# EAGLE design 32BVer0 (EAGLE 5.11)

## Sheet 1 of 3
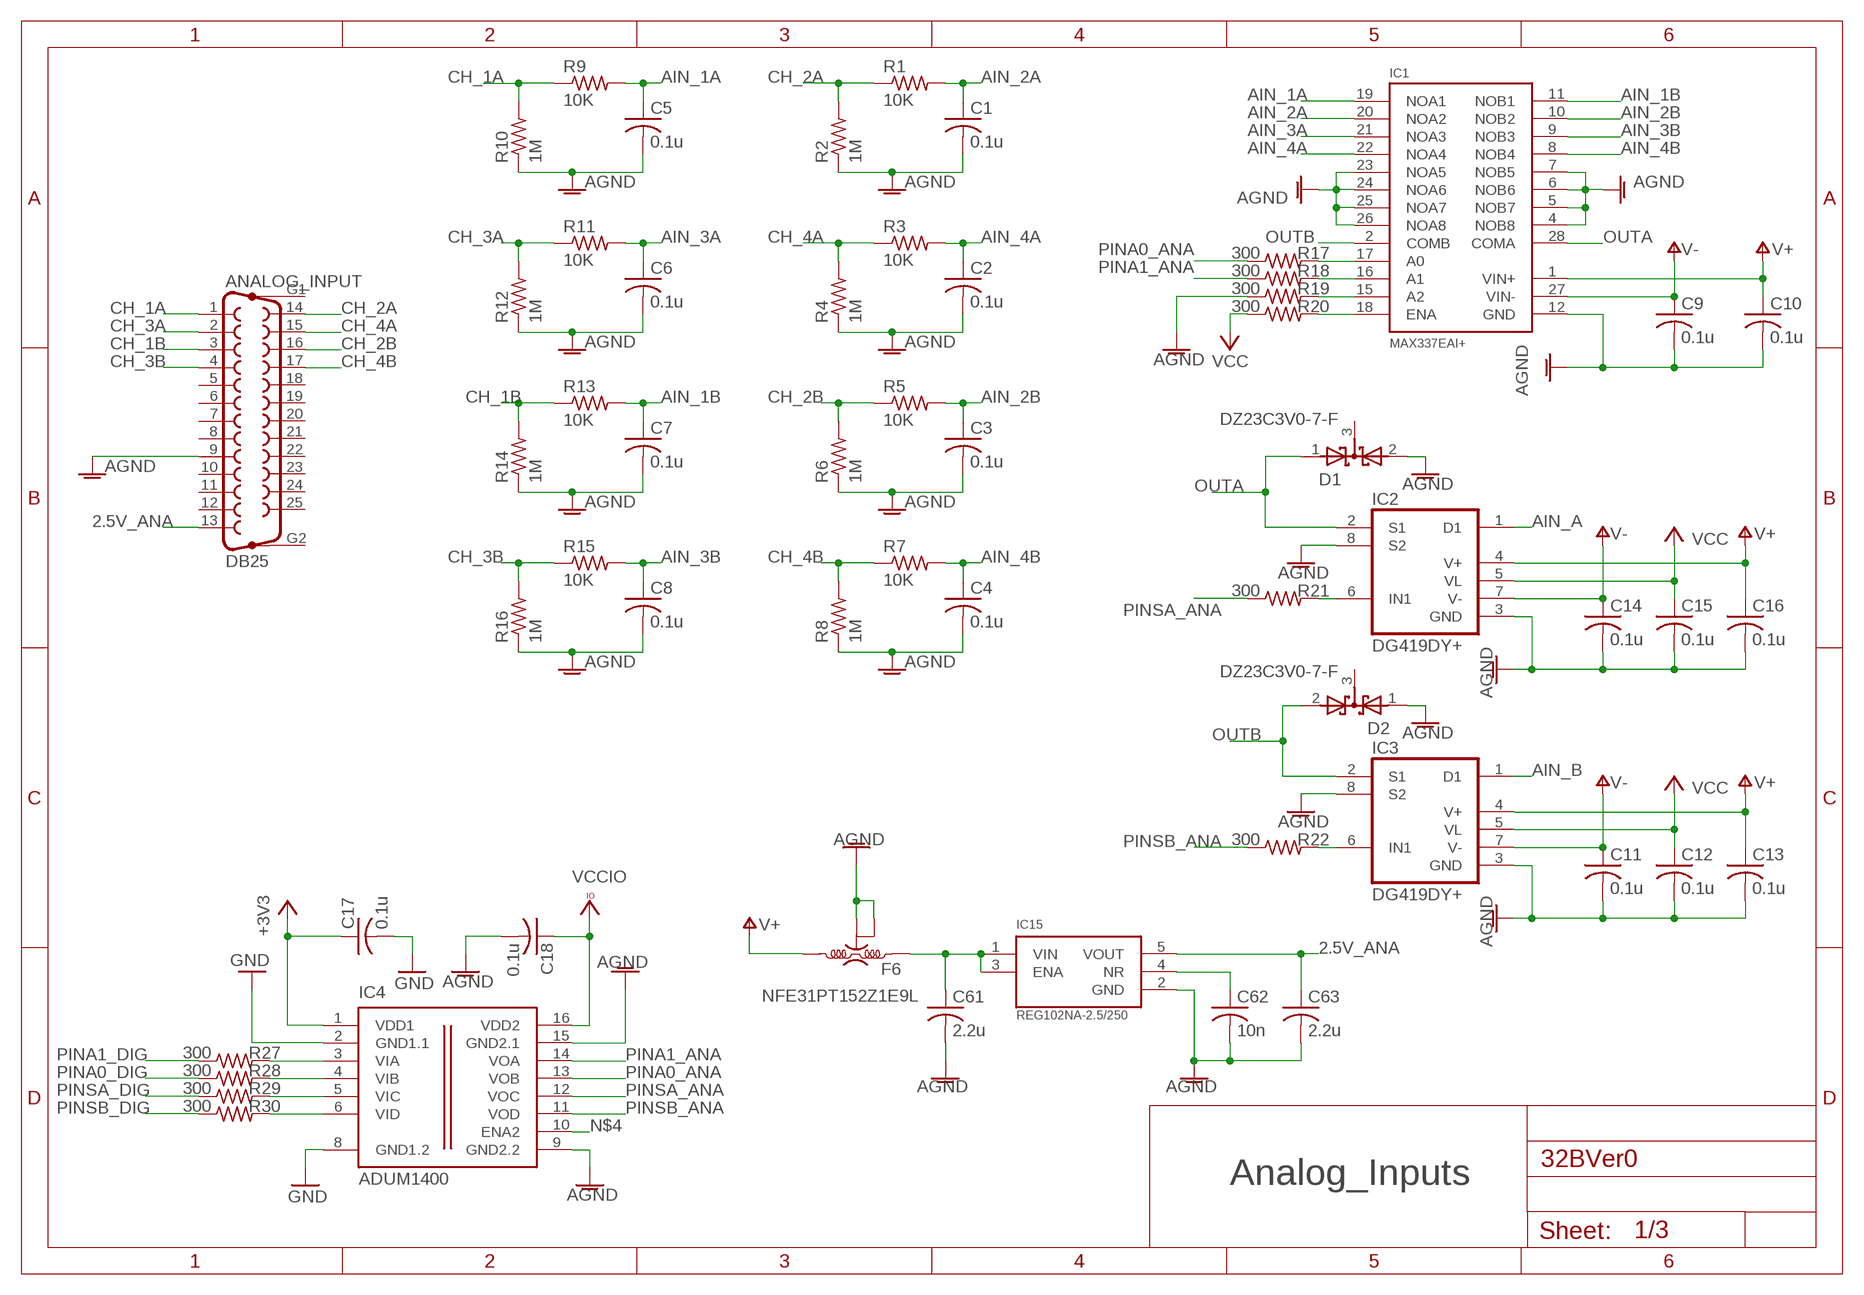
[diagram p0: schematic, sheet 1]

### Parts
ANALOG_INPUT  DB25  F25HP  [F25HP@1]
C1  0.1u  C-USC0603  [C0603]
C2  0.1u  C-USC0603  [C0603]
C3  0.1u  C-USC0603  [C0603]
C4  0.1u  C-USC0603  [C0603]
C5  0.1u  C-USC0603  [C0603]
C6  0.1u  C-USC0603  [C0603]
C7  0.1u  C-USC0603  [C0603]
C8  0.1u  C-USC0603  [C0603]
C9  0.1u  C-USC0603  [C0603]
C10  0.1u  C-USC0603  [C0603]
C11  0.1u  C-USC0603  [C0603]
C12  0.1u  C-USC0603  [C0603]
C13  0.1u  C-USC0603  [C0603]
C14  0.1u  C-USC0603  [C0603]
C15  0.1u  C-USC0603  [C0603]
C16  0.1u  C-USC0603  [C0603]
C17  0.1u  C-USC0603  [C0603]
C18  0.1u  C-USC0603  [C0603]
C61  2.2u  C-USC0603  [C0603]
C62  10n  C-USC0603  [C0603]
C63  2.2u  C-USC0603  [C0603]
D1  DZ23C3V0-7-F  [SOT23]
D2  DZ23C3V0-7-F  [SOT23]
F6  NFE31PT152Z1E9L  [KNF21]
IC1  MAX337EAI+  [SSOP28]
IC2  DG419DY+  [SO08]
IC3  DG419DY+  [SO08]
IC4  ADUM1400  [SO16W]
IC15  REG102NA-2.5/250  REG102-2V5  [SOT23-5]
R1  10K  R-US_R0603  [R0603]
R2  1M  R-US_R0603  [R0603]
R3  10K  R-US_R0603  [R0603]
R4  1M  R-US_R0603  [R0603]
R5  10K  R-US_R0603  [R0603]
R6  1M  R-US_R0603  [R0603]
R7  10K  R-US_R0603  [R0603]
R8  1M  R-US_R0603  [R0603]
R9  10K  R-US_R0603  [R0603]
R10  1M  R-US_R0603  [R0603]
R11  10K  R-US_R0603  [R0603]
R12  1M  R-US_R0603  [R0603]
R13  10K  R-US_R0603  [R0603]
R14  1M  R-US_R0603  [R0603]
R15  10K  R-US_R0603  [R0603]
R16  1M  R-US_R0603  [R0603]
R17  300  R-US_R0603  [R0603]
R18  300  R-US_R0603  [R0603]
R19  300  R-US_R0603  [R0603]
R20  300  R-US_R0603  [R0603]
R21  300  R-US_R0603  [R0603]
R22  300  R-US_R0603  [R0603]
R27  300  R-US_R0603  [R0603]
R28  300  R-US_R0603  [R0603]
R29  300  R-US_R0603  [R0603]
R30  300  R-US_R0603  [R0603]

### Nets
2.5V_ANA: ANALOG_INPUT.13 C63.1 IC15.5(VOUT)
+3V3: C17.1 IC4.1(VDD1) ; also sheet 2,3
AGND: ANALOG_INPUT.9 C1.2 C2.2 C3.2 C4.2 C5.2 C6.2 C7.2 C8.2 C9.2 C10.2 C11.2 C12.2 C13.2 C14.2 C15.2 C16.2 C18.2 C61.2 C62.2 C63.2 D1.2(A2) D2.1(A1) F6.2A(G1) F6.2B(G2) IC1.4(NOB8) IC1.5(NOB7) IC1.6(NOB6) IC1.7(NOB5) IC1.12(GND) IC1.23(NOA5) IC1.24(NOA6) IC1.25(NOA7) IC1.26(NOA8) IC2.3(GND) IC2.8(S2) IC3.3(GND) IC3.8(S2) IC4.9(GND2.2) IC4.15(GND2.1) IC15.2(GND) R2.1 R4.1 R6.1 R8.1 R10.1 R12.1 R14.1 R16.1 R19.1 ; also sheet 2,3
AIN_1A: C5.1 IC1.19(NOA1) R9.2
AIN_1B: C7.1 IC1.11(NOB1) R13.2
AIN_2A: C1.1 IC1.20(NOA2) R1.2
AIN_2B: C3.1 IC1.10(NOB2) R5.2
AIN_3A: C6.1 IC1.21(NOA3) R11.2
AIN_3B: C8.1 IC1.9(NOB3) R15.2
AIN_4A: C2.1 IC1.22(NOA4) R3.2
AIN_4B: C4.1 IC1.8(NOB4) R7.2
AIN_A: IC2.1(D1) ; also sheet 2
AIN_B: IC3.1(D1) ; also sheet 2
CH_1A: ANALOG_INPUT.1 R9.1 R10.2
CH_1B: ANALOG_INPUT.3 R13.1 R14.2
CH_2A: ANALOG_INPUT.14 R1.1 R2.2
CH_2B: ANALOG_INPUT.16 R5.1 R6.2
CH_3A: ANALOG_INPUT.2 R11.1 R12.2
CH_3B: ANALOG_INPUT.4 R15.1 R16.2
CH_4A: ANALOG_INPUT.15 R3.1 R4.2
CH_4B: ANALOG_INPUT.17 R7.1 R8.2
GND: C17.2 IC4.2(GND1.1) IC4.8(GND1.2) ; also sheet 2,3
N$4: IC4.10(ENA2)
N$6: C61.1 F6.1(IN) IC15.1(VIN) IC15.3(ENA)
N$8: C62.1 IC15.4(NR)
N$18: IC1.18(ENA) R20.2
N$19: IC1.15(A2) R19.2
N$20: IC1.16(A1) R18.2
N$21: IC1.17(A0) R17.2
N$32: IC2.6(IN1) R21.2
N$33: IC3.6(IN1) R22.2
N$37: IC4.3(VIA) R27.2
N$38: IC4.4(VIB) R28.2
N$39: IC4.5(VIC) R29.2
N$40: IC4.6(VID) R30.2
OUTA: D1.1(A1) IC1.28(COMA) IC2.2(S1)
OUTB: D2.2(A2) IC1.2(COMB) IC3.2(S1)
PINA0_ANA: IC4.13(VOB) R17.1
PINA0_DIG: R28.1 ; also sheet 3
PINA1_ANA: IC4.14(VOA) R18.1
PINA1_DIG: R27.1 ; also sheet 3
PINSA_ANA: IC4.12(VOC) R21.1
PINSA_DIG: R29.1 ; also sheet 3
PINSB_ANA: IC4.11(VOD) R22.1
PINSB_DIG: R30.1 ; also sheet 3
V+: C10.1 C13.1 C16.1 F6.3(OUT) IC1.1(VIN+) IC2.4(V+) IC3.4(V+) ; also sheet 2,3
V-: C9.1 C11.1 C14.1 IC1.27(VIN-) IC2.7(V-) IC3.7(V-) ; also sheet 2,3
VCC: C12.1 C15.1 IC2.5(VL) IC3.5(VL) R20.1 ; also sheet 2
VCCIO: C18.1 IC4.16(VDD2) ; also sheet 2
Unconnected: ANALOG_INPUT.5 ANALOG_INPUT.6 ANALOG_INPUT.7 ANALOG_INPUT.8 ANALOG_INPUT.10 ANALOG_INPUT.11 ANALOG_INPUT.12 ANALOG_INPUT.18 ANALOG_INPUT.19 ANALOG_INPUT.20 ANALOG_INPUT.21 ANALOG_INPUT.22 ANALOG_INPUT.23 ANALOG_INPUT.24 ANALOG_INPUT.25 ANALOG_INPUT.G1 ANALOG_INPUT.G2 D1.3 D2.3

### Notes on the sheet
- Analog_Inputs

## Sheet 2 of 3
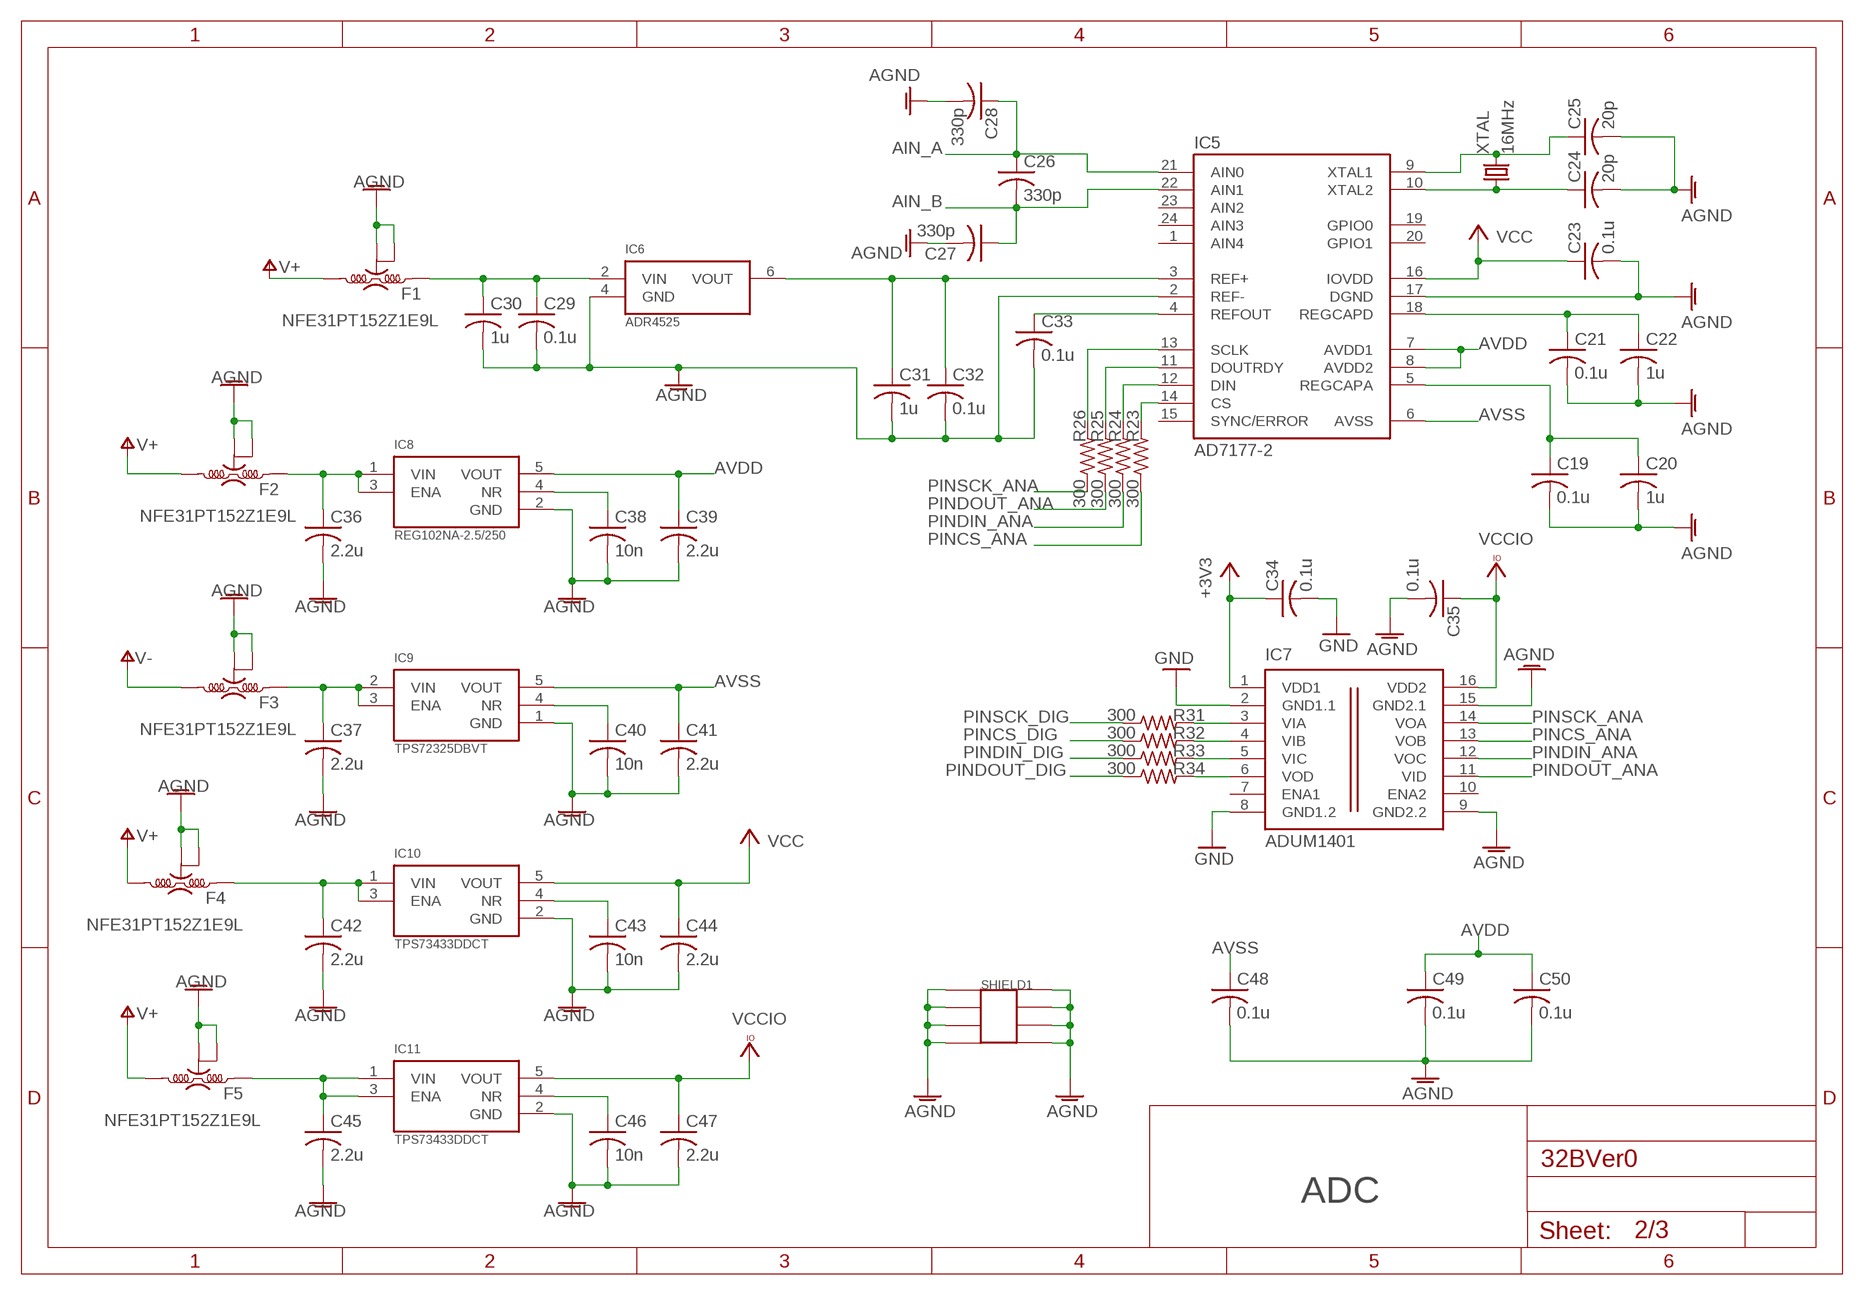
[diagram p1: schematic, sheet 2]

### Parts
C19  0.1u  C-USC0402  [C0402]
C20  1u  C-USC0402  [C0402]
C21  0.1u  C-USC0402  [C0402]
C22  1u  C-USC0402  [C0402]
C23  0.1u  C-USC0402  [C0402]
C24  20p  C-USC0402  [C0402]
C25  20p  C-USC0402  [C0402]
C26  330p  C-USC0402  [C0402]
C27  330p  C-USC0402  [C0402]
C28  330p  C-USC0402  [C0402]
C29  0.1u  C-USC0402  [C0402]
C30  1u  C-USC0402  [C0402]
C31  1u  C-USC0402  [C0402]
C32  0.1u  C-USC0402  [C0402]
C33  0.1u  C-USC0402  [C0402]
C34  0.1u  C-USC0603  [C0603]
C35  0.1u  C-USC0603  [C0603]
C36  2.2u  C-USC0603  [C0603]
C37  2.2u  C-USC0603  [C0603]
C38  10n  C-USC0603  [C0603]
C39  2.2u  C-USC0603  [C0603]
C40  10n  C-USC0603  [C0603]
C41  2.2u  C-USC0603  [C0603]
C42  2.2u  C-USC0603  [C0603]
C43  10n  C-USC0603  [C0603]
C44  2.2u  C-USC0603  [C0603]
C45  2.2u  C-USC0603  [C0603]
C46  10n  C-USC0603  [C0603]
C47  2.2u  C-USC0603  [C0603]
C48  0.1u  C-USC0402  [C0402]
C49  0.1u  C-USC0402  [C0402]
C50  0.1u  C-USC0402  [C0402]
F1  NFE31PT152Z1E9L  [KNF21]
F2  NFE31PT152Z1E9L  [KNF21]
F3  NFE31PT152Z1E9L  [KNF21]
F4  NFE31PT152Z1E9L  [KNF21]
F5  NFE31PT152Z1E9L  [KNF21]
IC5  AD7177-2  AD7177-2BRUZ  [TSSOP24]
IC6  ADR4525  ADR4525CRZ-R7  [SO08]
IC7  ADUM1401  [SO16W]
IC8  REG102NA-2.5/250  REG102-2V5  [SOT23-5]
IC9  TPS72325DBVT  [SOT23-5]
IC10  TPS73433DDCT  [SOT23-5]
IC11  TPS73433DDCT  [SOT23-5]
R23  300  R-US_R0603  [R0603]
R24  300  R-US_R0603  [R0603]
R25  300  R-US_R0603  [R0603]
R26  300  R-US_R0603  [R0603]
R31  300  R-US_R0603  [R0603]
R32  300  R-US_R0603  [R0603]
R33  300  R-US_R0603  [R0603]
R34  300  R-US_R0603  [R0603]
SHIELD1  SHIELD_50X38  [SHIELD_38X50]
XTAL  16MHz  CRYSTALSM49  [SM49]

### Nets
+3V3: C34.1 IC7.1(VDD1) ; also sheet 1,3
AGND: C19.2 C20.2 C21.2 C22.2 C23.2 C24.2 C25.2 C27.2 C28.2 C29.2 C30.2 C31.2 C32.2 C33.2 C35.2 C36.2 C37.2 C38.2 C39.2 C40.2 C41.2 C42.2 C43.2 C44.2 C45.2 C46.2 C47.2 C48.2 C49.2 C50.2 F1.2A(G1) F1.2B(G2) F2.2A(G1) F2.2B(G2) F3.2A(G1) F3.2B(G2) F4.2A(G1) F4.2B(G2) F5.2A(G1) F5.2B(G2) IC5.2(REF-) IC5.17(DGND) IC6.4(GND) IC7.9(GND2.2) IC7.15(GND2.1) IC8.2(GND) IC9.1(GND) IC10.2(GND) IC11.2(GND) SHIELD1.P$1 SHIELD1.P$2 SHIELD1.P$3 SHIELD1.P$4 SHIELD1.P$5 SHIELD1.P$6 SHIELD1.P$7 SHIELD1.P$8 ; also sheet 1,3
AIN_A: C26.1 C28.1 IC5.21(AIN0) ; also sheet 1
AIN_B: C26.2 C27.1 IC5.22(AIN1) ; also sheet 1
AVDD: C39.1 C49.1 C50.1 IC5.7(AVDD1) IC5.8(AVDD2) IC8.5(VOUT)
AVSS: C41.1 C48.1 IC5.6(AVSS) IC9.5(VOUT)
GND: C34.2 IC7.2(GND1.1) IC7.8(GND1.2) ; also sheet 1,3
N$1: C45.1 F5.1(IN) IC11.1(VIN) IC11.3(ENA)
N$2: C21.1 C22.1 IC5.18(REGCAPD)
N$3: C24.1 IC5.10(XTAL2) XTAL.1
N$5: C19.1 C20.1 IC5.5(REGCAPA)
N$7: C25.1 IC5.9(XTAL1) XTAL.2
N$9: C29.1 C30.1 F1.1(IN) IC6.2(VIN)
N$11: C33.1 IC5.4(REFOUT)
N$13: C31.1 C32.1 IC5.3(REF+) IC6.6(VOUT)
N$15: IC5.13(SCLK) R26.2
N$17: IC5.11(DOUTRDY) R25.2
N$22: IC5.12(DIN) R24.2
N$23: IC5.14(CS) R23.2
N$24: C42.1 F4.1(IN) IC10.1(VIN) IC10.3(ENA)
N$25: C37.1 F3.1(IN) IC9.2(VIN) IC9.3(ENA)
N$26: C36.1 F2.1(IN) IC8.1(VIN) IC8.3(ENA)
N$27: C40.1 IC9.4(NR)
N$28: IC7.3(VIA) R31.2
N$29: C38.1 IC8.4(NR)
N$30: C43.1 IC10.4(NR)
N$31: IC7.4(VIB) R32.2
N$34: IC7.5(VIC) R33.2
N$35: IC7.6(VOD) R34.2
N$36: C46.1 IC11.4(NR)
PINCS_ANA: IC7.13(VOB) R23.1
PINCS_DIG: R32.1 ; also sheet 3
PINDIN_ANA: IC7.12(VOC) R24.1
PINDIN_DIG: R33.1 ; also sheet 3
PINDOUT_ANA: IC7.11(VID) R25.1
PINDOUT_DIG: R34.1 ; also sheet 3
PINSCK_ANA: IC7.14(VOA) R26.1
PINSCK_DIG: R31.1 ; also sheet 3
V+: F1.3(OUT) F2.3(OUT) F4.3(OUT) F5.3(OUT) ; also sheet 1,3
V-: F3.3(OUT) ; also sheet 1,3
VCC: C23.1 C44.1 IC5.16(IOVDD) IC10.5(VOUT) ; also sheet 1
VCCIO: C35.1 C47.1 IC7.16(VDD2) IC11.5(VOUT) ; also sheet 1
Unconnected: IC5.1(AIN4) IC5.15(SYNC/ERROR) IC5.19(GPIO0) IC5.20(GPIO1) IC5.23(AIN2) IC5.24(AIN3)

### Notes on the sheet
- ADC

## Sheet 3 of 3
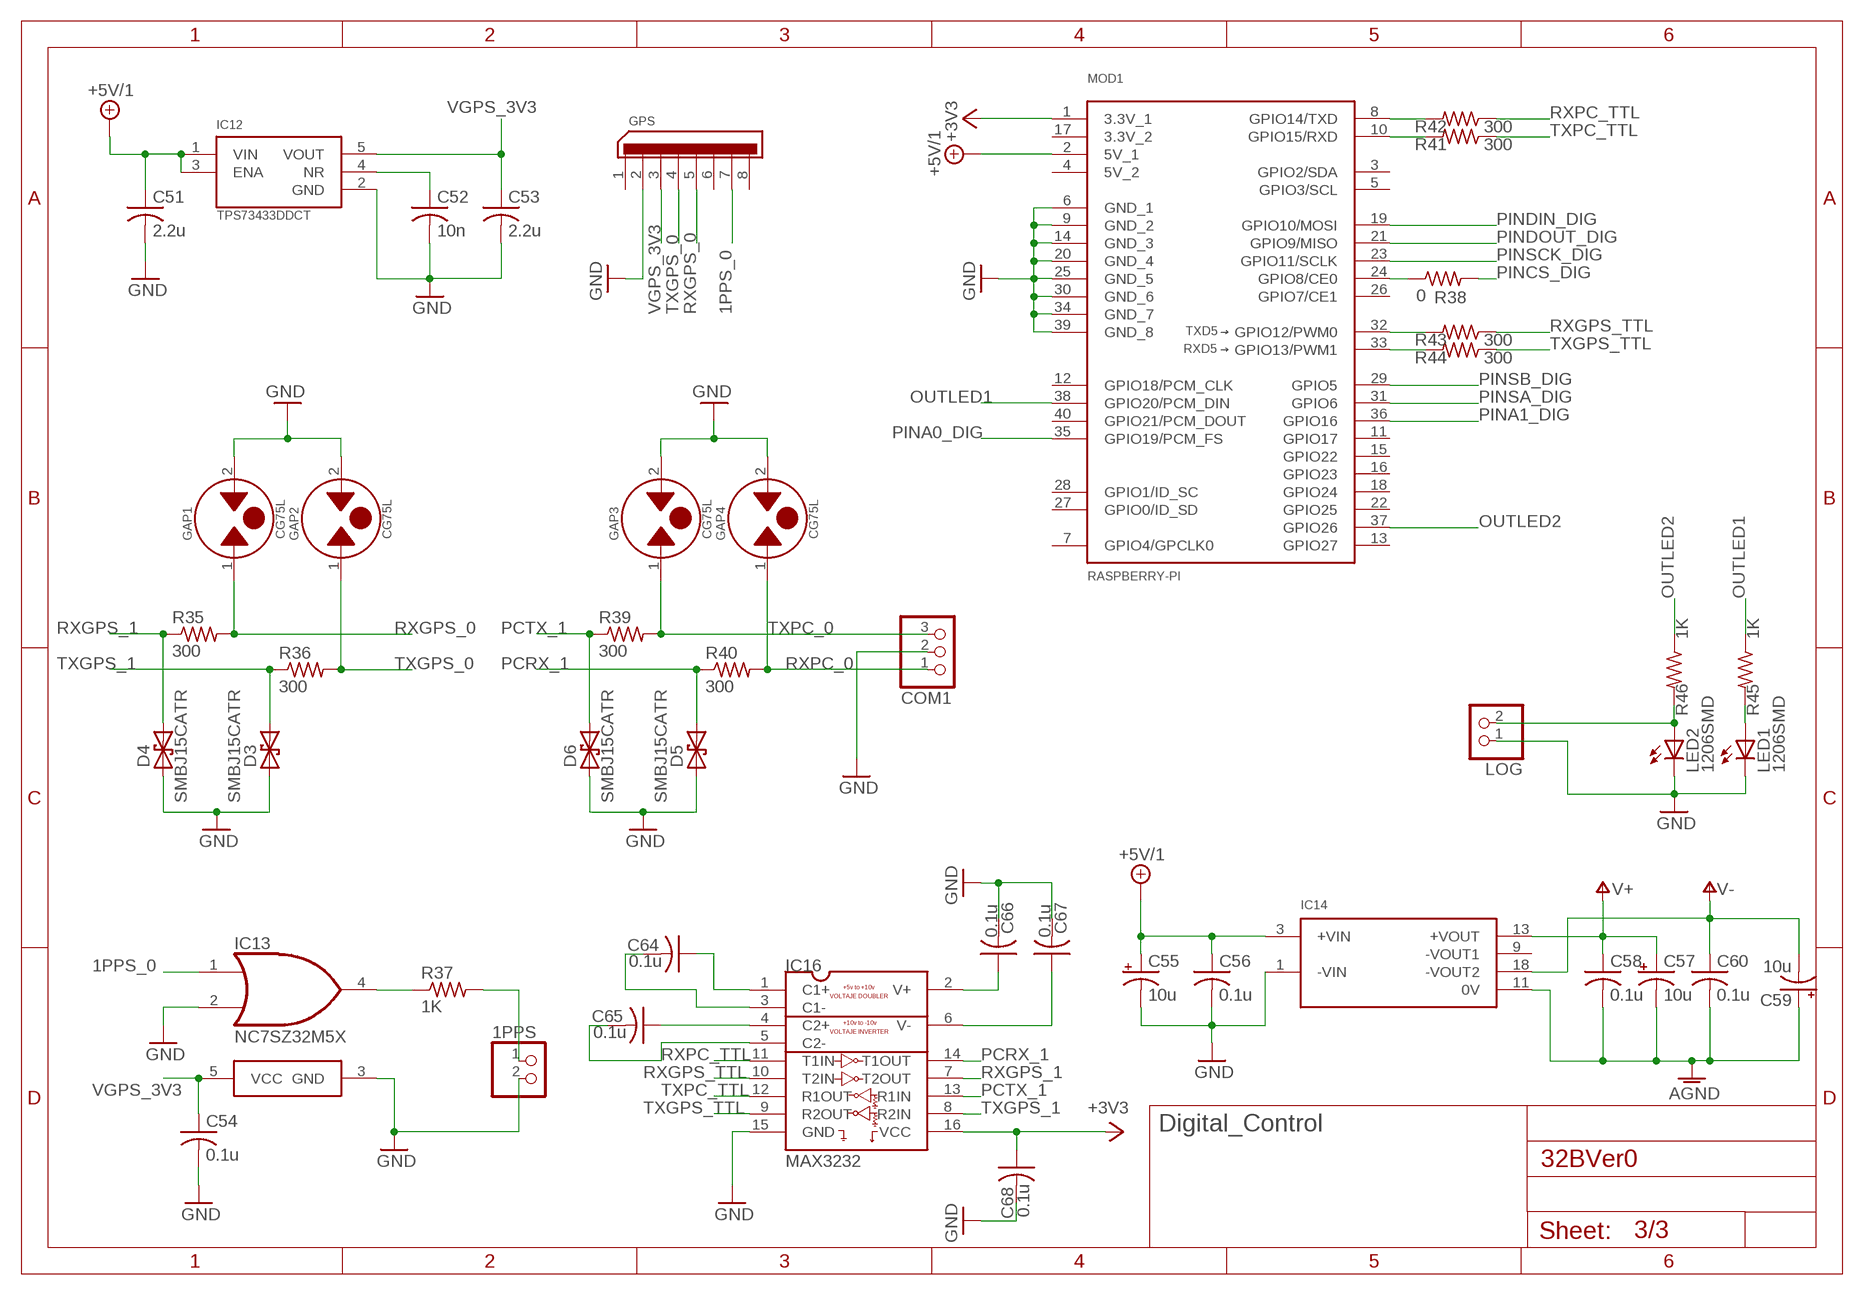
[diagram p2: schematic, sheet 3]

### Parts
1PPS  PINHD-1X2  [1X02]
C51  2.2u  C-USC0603  [C0603]
C52  10n  C-USC0603  [C0603]
C53  2.2u  C-USC0603  [C0603]
C54  0.1u  C-USC0603  [C0603]
C55  10u  CPOL-USA/3216-18W  [A/3216-18W]
C56  0.1u  C-USC0603  [C0603]
C57  10u  CPOL-USA/3216-18W  [A/3216-18W]
C58  0.1u  C-USC0603  [C0603]
C59  10u  CPOL-USA/3216-18W  [A/3216-18W]
C60  0.1u  C-USC0603  [C0603]
C64  0.1u  C-USC0603  [C0603]
C65  0.1u  C-USC0603  [C0603]
C66  0.1u  C-USC0603  [C0603]
C67  0.1u  C-USC0603  [C0603]
C68  0.1u  C-USC0603  [C0603]
COM1  PINHD-1X3  [1X03]
D3  SMBJ15CATR  [DO214AA]
D4  SMBJ15CATR  [DO214AA]
D5  SMBJ15CATR  [DO214AA]
D6  SMBJ15CATR  [DO214AA]
GAP1  CG75L  [GAP]
GAP2  CG75L  [GAP]
GAP3  CG75L  [GAP]
GAP4  CG75L  [GAP]
GPS  MOLEX_FLEX8  [MOLEX_FLEX8PIN]
IC12  TPS73433DDCT  [SOT23-5]
IC13  NC7SZ32M5X  [SOT23-5]
IC14  NTH0505MC  [26-SMD]
IC16  MAX3232  MAX3232IDR  [SO16]
LED1  1206SMD  LEDCHIPLED_1206  [CHIPLED_1206]
LED2  1206SMD  LEDCHIPLED_1206  [CHIPLED_1206]
LOG  PINHD-1X2  [1X02]
MOD1  RASPBERRY-PI  PINES_RASPI  [FE20-2]
R35  300  R-US_R0603  [R0603]
R36  300  R-US_R0603  [R0603]
R37  1K  R-US_R0603  [R0603]
R38  0  R-US_R0603  [R0603]
R39  300  R-US_R0603  [R0603]
R40  300  R-US_R0603  [R0603]
R41  300  R-US_R0603  [R0603]
R42  300  R-US_R0603  [R0603]
R43  300  R-US_R0603  [R0603]
R44  300  R-US_R0603  [R0603]
R45  1K  R-US_R0603  [R0603]
R46  1K  R-US_R0603  [R0603]

### Nets
1PPS_0: GPS.7 IC13.1(I0)
+3V3: C68.1 IC16.16(VCC) MOD1.1(3.3V_1) ; also sheet 1,2
+5V/1: C51.1 C55.+ C56.1 IC12.1(VIN) IC12.3(ENA) IC14.3(+VIN) MOD1.2(5V_1)
AGND: C57.- C58.2 C59.+ C60.2 IC14.11(0V) ; also sheet 1,2
GND: 1PPS.2 C51.2 C52.2 C53.2 C54.2 C55.- C56.2 C66.2 C67.2 C68.2 COM1.2 D3.A(A1) D4.A(A1) D5.A(A1) D6.A(A1) GAP1.2 GAP2.2 GAP3.2 GAP4.2 GPS.2 IC12.2(GND) IC13.2(I1) IC13.3(GND) IC14.1(-VIN) IC16.15(GND) LED1.C LED2.C LOG.1 MOD1.6(GND_1) MOD1.9(GND_2) MOD1.14(GND_3) MOD1.20(GND_4) MOD1.25(GND_5) MOD1.30(GND_6) MOD1.34(GND_7) MOD1.39(GND_8) ; also sheet 1,2
N$41: 1PPS.1 R37.2
N$42: IC13.4(O) R37.1
N$43: MOD1.24(GPIO8/CE0) R38.1
N$44: C64.1 IC16.1(C1+)
N$45: C52.1 IC12.4(NR)
N$46: C64.2 IC16.3(C1-)
N$47: C65.1 IC16.4(C2+)
N$48: C65.2 IC16.5(C2-)
N$49: MOD1.10(GPIO15/RXD) R41.2
N$50: C66.1 IC16.2(V+)
N$51: C67.1 IC16.6(V-)
N$52: MOD1.8(GPIO14/TXD) R42.2
N$53: MOD1.32(GPIO12/PWM0) R43.2
N$55: MOD1.33(GPIO13/PWM1) R44.2
N$57: LED1.A R45.2
N$63: LED2.A LOG.2 R46.2
OUTLED1: MOD1.38(GPIO20/PCM_DIN) R45.1
OUTLED2: MOD1.37(GPIO26) R46.1
PCRX_1: D5.C(A2) IC16.14(T1OUT) R40.1
PCTX_1: D6.C(A2) IC16.13(R1IN) R39.1
PINA0_DIG: MOD1.35(GPIO19/PCM_FS) ; also sheet 1
PINA1_DIG: MOD1.36(GPIO16) ; also sheet 1
PINCS_DIG: R38.2 ; also sheet 2
PINDIN_DIG: MOD1.19(GPIO10/MOSI) ; also sheet 2
PINDOUT_DIG: MOD1.21(GPIO9/MISO) ; also sheet 2
PINSA_DIG: MOD1.31(GPIO6) ; also sheet 1
PINSB_DIG: MOD1.29(GPIO5) ; also sheet 1
PINSCK_DIG: MOD1.23(GPIO11/SCLK) ; also sheet 2
RXGPS_0: GAP1.1 GPS.5 R35.2
RXGPS_1: D4.C(A2) IC16.7(T2OUT) R35.1
RXGPS_TTL: IC16.10(T2IN) R43.1
RXPC_0: COM1.1 GAP4.1 R40.2
RXPC_TTL: IC16.11(T1IN) R42.1
TXGPS_0: GAP2.1 GPS.4 R36.2
TXGPS_1: D3.C(A2) IC16.8(R2IN) R36.1
TXGPS_TTL: IC16.9(R2OUT) R44.1
TXPC_0: COM1.3 GAP3.1 R39.2
TXPC_TTL: IC16.12(R1OUT) R41.1
V+: C57.+ C58.1 IC14.13(+VOUT) ; also sheet 1,2
V-: C59.- C60.1 IC14.18(-VOUT2) ; also sheet 1,2
VGPS_3V3: C53.1 C54.1 GPS.3 IC12.5(VOUT) IC13.5(VCC)
Unconnected: GPS.1 GPS.6 GPS.8 MOD1.3(GPIO2/SDA) MOD1.5(GPIO3/SCL) MOD1.7(GPIO4/GPCLK0) MOD1.11(GPIO17) MOD1.12(GPIO18/PCM_CLK) MOD1.13(GPIO27) MOD1.15(GPIO22) MOD1.16(GPIO23) MOD1.18(GPIO24) MOD1.22(GPIO25) MOD1.26(GPIO7/CE1) MOD1.27(GPIO0/ID_SD) MOD1.28(GPIO1/ID_SC) MOD1.40(GPIO21/PCM_DOUT)

### Notes on the sheet
- TXD5
- RXD5
- Digital_Control

## Power pins joined to a net without a drawn wire
3.3V_2: MOD1.17(3.3V_2)
5V_2: MOD1.4(5V_2)
-VOUT1: IC14.9(-VOUT1)
ENA1: IC7.7(ENA1)
ENA2: IC7.10(ENA2)

## Library data of the parts
1PPS LOG = pinhead:PINHD-1X2: PIN HEADER
ANALOG_INPUT = con-subd:F25HP: SUB-D; OC_FARNELL: unknown; OC_NEWARK: unknown
C1-C54 C56 C58 C60-C68 = rcl:C-US: CAPACITOR, American symbol
C55 C57 C59 = rcl:CPOL-US: POLARIZED CAPACITOR, American symbol
COM1 = pinhead:PINHD-1X3: PIN HEADER
D1 D2 = LibraryMagnet:DZ23C3V0-7-F
D3-D6 = LibraryMagnet:SMBJ15CATR
F1-F6 = LibraryMagnet:NFE31PT152Z1E9L
GAP1-GAP4 = magnetometro:CG75L
GPS = magnetometro:MOLEX_FLEX8
IC1 = LibraryMagnet:MAX337EAI+
IC2 IC3 = LibraryMagnet:DG419DY+
IC4 = LibraryMagnet:ADUM1400
IC5 = LibraryMagnet:AD7177-2BRUZ
IC6 = LibraryMagnet:ADR4525CRZ-R7
IC7 = LibraryMagnet:ADUM1401
IC8 IC15 = LibraryMagnet:REG102-2V5
IC9 = LibraryMagnet:TPS72325DBVT
IC10-IC12 = LibraryMagnet:TPS73433DDCT
IC13 = LibraryMagnet:NC7SZ32M5X
IC14 = LibraryMagnet:NTH0505MC
IC16 = LibraryMagnet:MAX3232IDR
LED1 LED2 = led:LED: LED OSRAM: - CHIPLED LG R971, LG N971, LY N971, LG Q971, LY Q971, LO R971, LY R971 LH N974, LH R974 LS Q976, LO Q976, LY Q976 LO Q996 - Hyper CHIPLED LW Q18S LB Q993, LB Q99A, LB R99A - SideLED LS A670, LO A670, LY A670, LG A670, LP A670 LB A673, LV A673, LT A673, LW A673 LH A674 LY A675 LS A676, LA A676, LO A676, LY A676, LW A676 LS A679, LY A679, LG A679 - Hyper Micro SIDELED® LS Y876, LA Y876, LO Y876, LY Y876 LT Y87S - SmartLED LW L88C, LW L88S LB L89C, LB L89S, LG L890 LS L89K, LO L89K, LY L89K LS L896, LA L896, LO L896, LY L896 - TOPLED LS T670, LO T670, LY T670, LG T670, LP T670 LSG T670, LSP T670, LSY T670, LOP T670, LYG T670 LG T671, LOG T671, LSG T671 LB T673, LV T673, LT T673, LW T673 LH T674 LS T676, LA T676, LO T676, LY T676, LB T676, LH T676, LSB T676, LW T676 LB T67C, LV T67C, LT T67C, LS T67K, LO T67K, LY T67K, LW E67C LS E67B, LA E67B, LO E67B, LY E67B, LB E67C, LV E67C, LT E67C LW T67C LS T679, LY T679, LG T679 LS T770, LO T770, LY T770, LG T770, LP T770 LB T773, LV T773, LT T773, LW T773 LH T774 LS E675, LA E675, LY E675, LS T675 LS T776, LA T776, LO T776, LY T776, LB T776 LHGB T686 LT T68C, LB T68C - Hyper Mini TOPLED® LB M676 - Mini TOPLED Santana® LG M470 LS M47K, LO M47K, LY M47K Source: http://www.osram.convergy.de LUXEON: - LUMILED® LXK2-PW12-R00, LXK2-PW12-S00, LXK2-PW14-U00, LXK2-PW14-V00 LXK2-PM12-R00, LXK2-PM12-S00, LXK2-PM14-U00 LXK2-PE12-Q00, LXK2-PE12-R00, LXK2-PE12-S00, LXK2-PE14-T00, LXK2-PE14-U00 LXK2-PB12-K00, LXK2-PB12-L00, LXK2-PB12-M00, LXK2-PB14-N00, LXK2-PB14-P00, LXK2-PB14-Q00 LXK2-PR12-L00, LXK2-PR12-M00, LXK2-PR14-Q00, LXK2-PR14-R00 LXK2-PD12-Q00, LXK2-PD12-R00, LXK2-PD12-S00 LXK2-PH12-R00, LXK2-PH12-S00 LXK2-PL12-P00, LXK2-PL12-Q00, LXK2-PL12-R00 Source: www.luxeon.com KINGBRIGHT: KA-3528ASYC Source: www.kingbright.com
MOD1 = LibraryMagnet:PINES_RASPI
R1-R46 = rcl:R-US_: RESISTOR, American symbol
SHIELD1 = magnetometro:SHIELD_50X38
XTAL = crystal:CRYSTAL: CRYSTAL; OC_FARNELL: unknown; OC_NEWARK: unknown

## Board
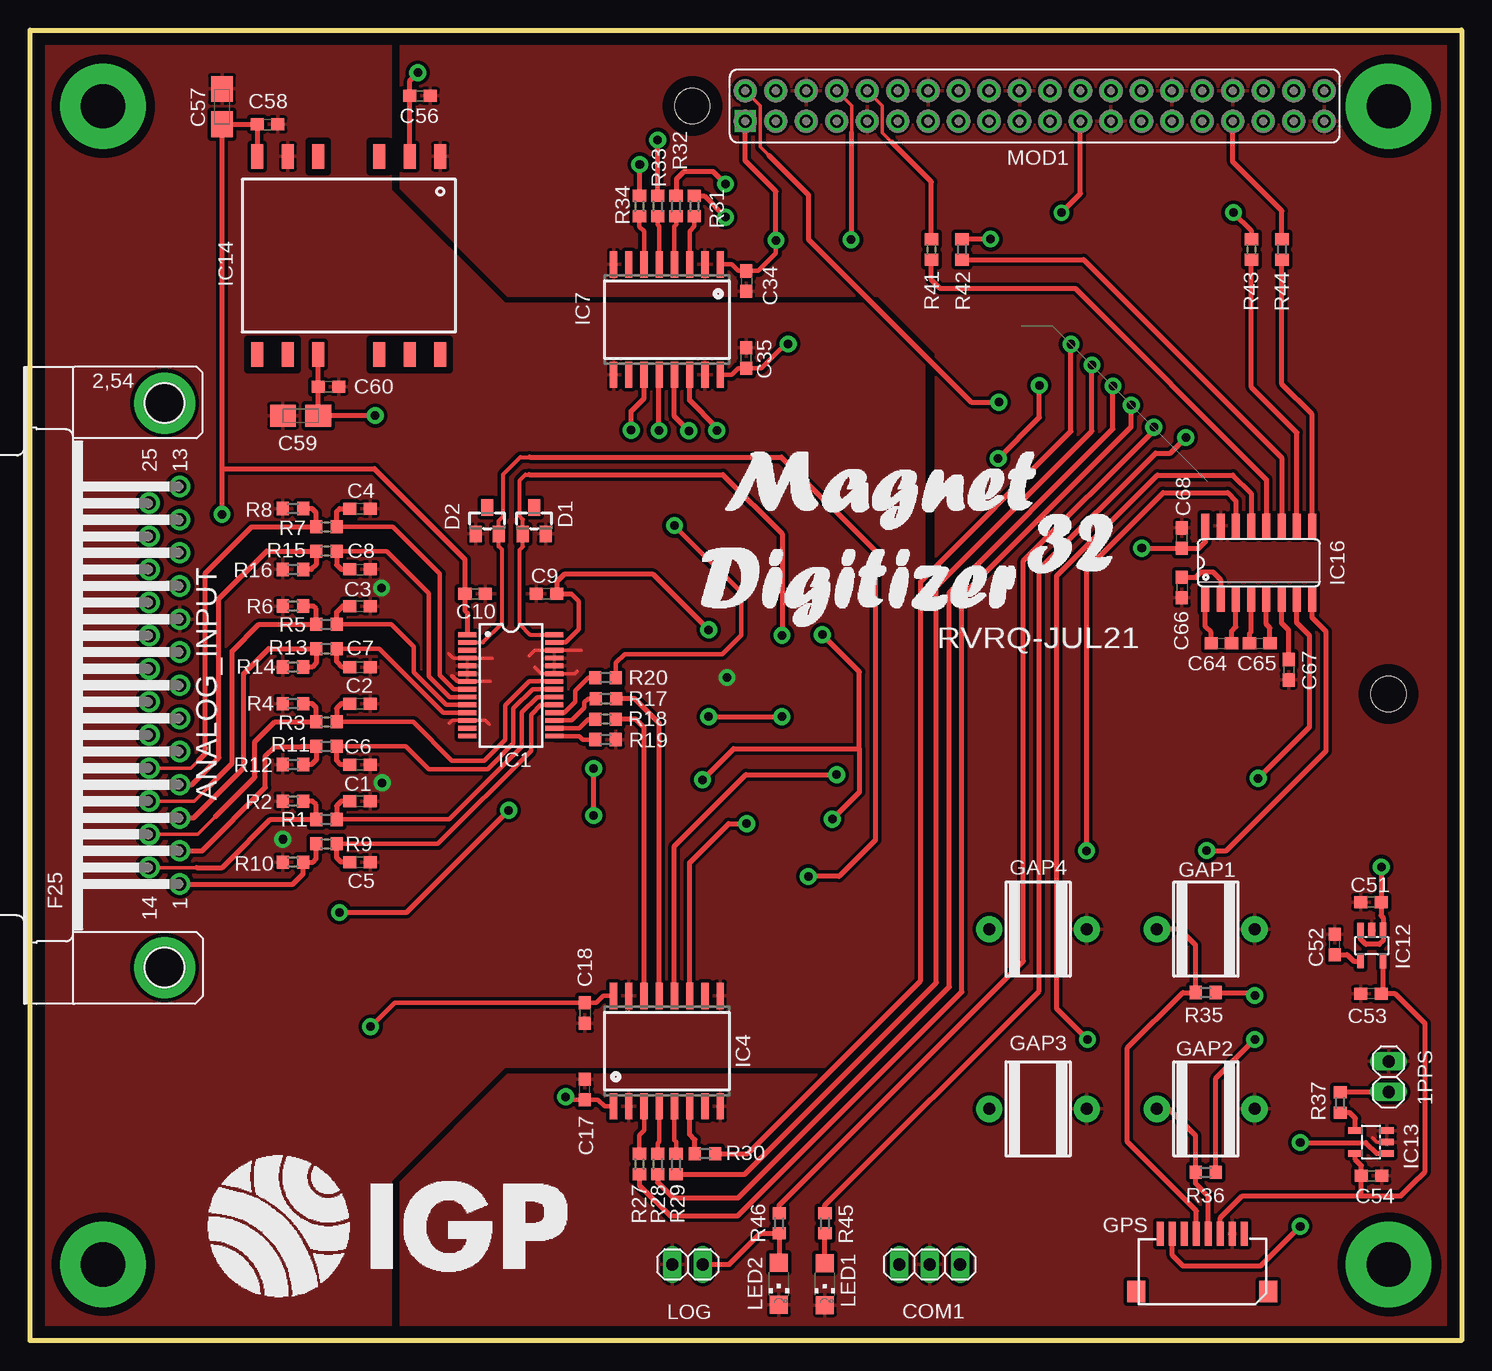
[diagram p3: board, top side]
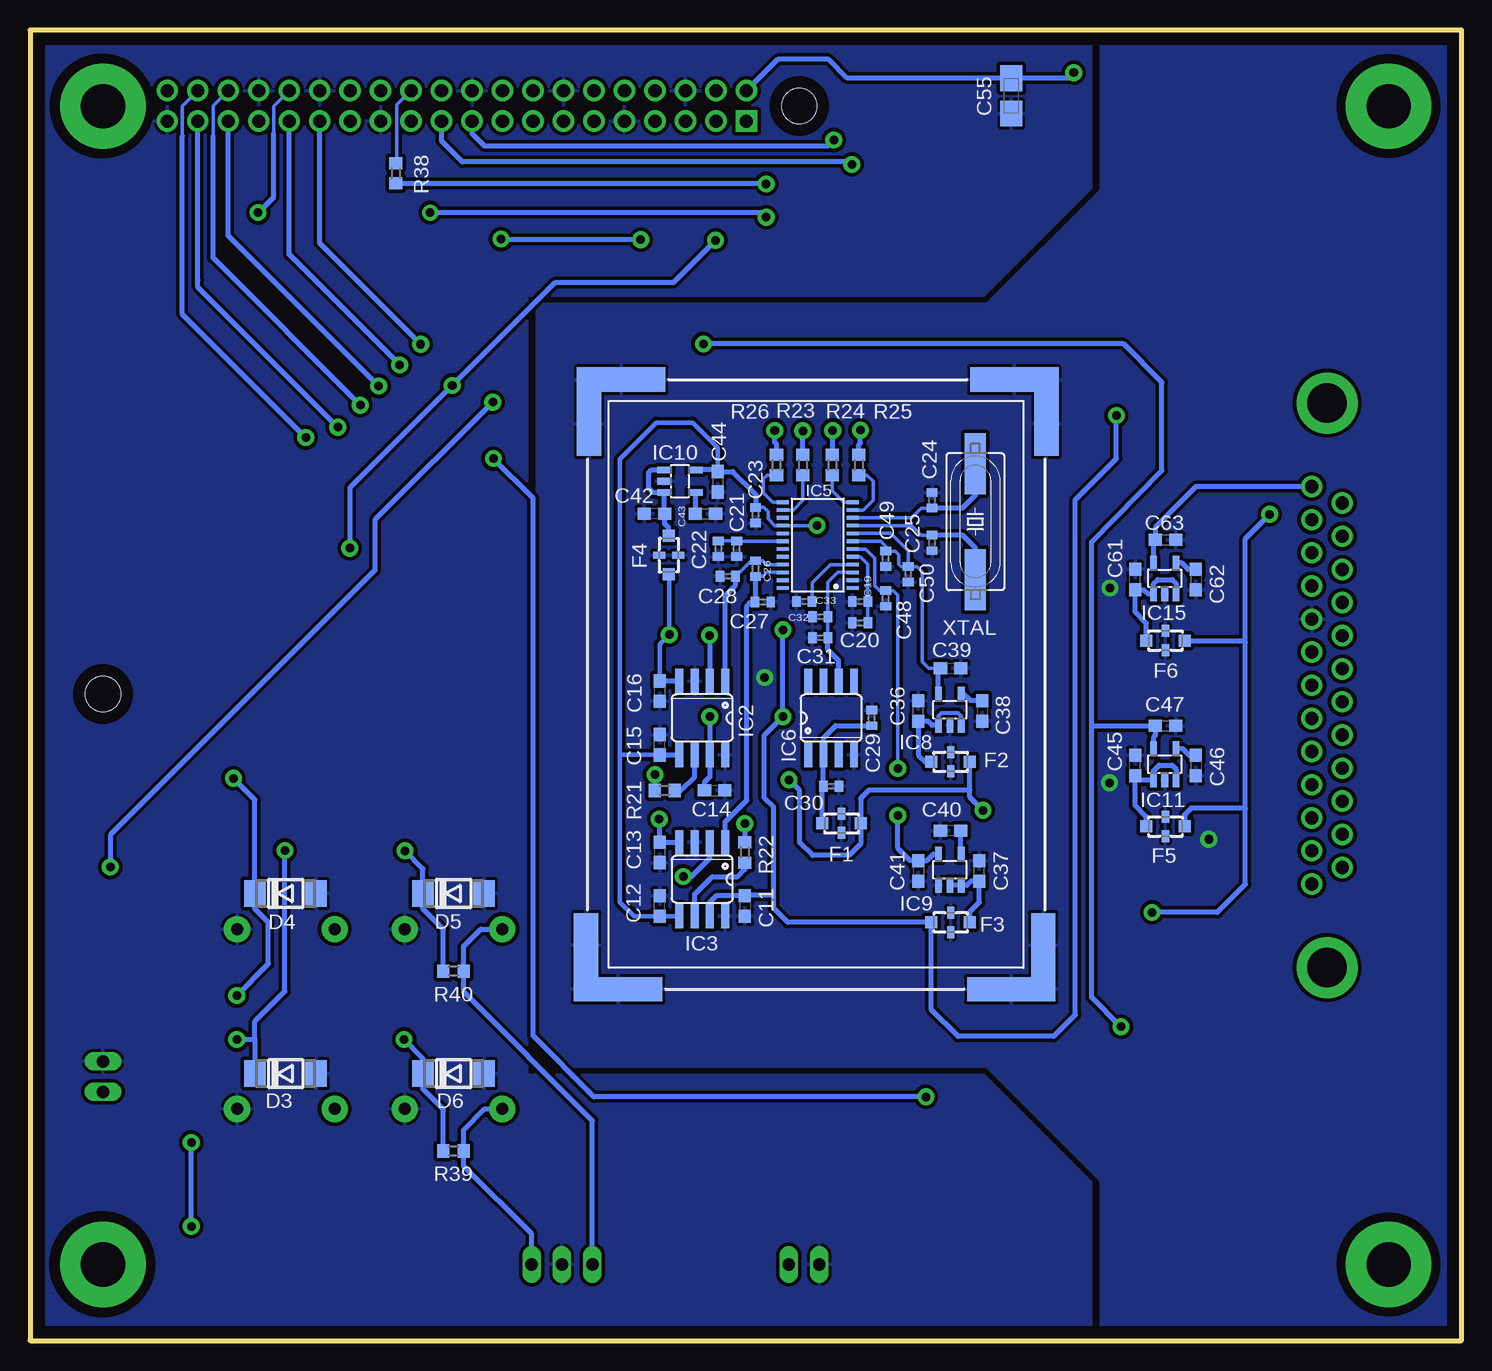
[diagram p4: board, bottom side, seen from below]

Size 119.3 x 109.22 mm. Coordinates in mm from the lower left corner, seen from the top.
Outline: 0,0 0,109.22 119.3,109.22 119.3,0 0,0
Copper layers (1*16): Top 0.035mm / dielectric 1.5mm / Bottom 0.035mm
Design rules "default": minimum track width 10mil, minimum drill 24mil, track to track 8mil, track to pad 8mil, pad to pad 8mil, via to via 8mil, smd to smd 8mil, copper to edge 40mil, drill to drill 8mil, minimum pad ring 10mil, minimum via ring 8mil, stop-mask expansion 4mil, vias tented up to drill 0mil, thermal gap 10mil
Holes 2.92 mm at 55.19,102.9 113.21,53.89
tRestrict: area 18.2,80.9 to 22.3,83.4; area 28.3,80.9 to 35,83.4; area 23.3,97.4 to 24.8,99.9; area 28.3,97.4 to 29.9,99.9; area 109.5,99.1 to 117.1,106.7; area 109.4,2.5 to 117.1,10.2; area 2.3,2.5 to 9.9,10.2; area 2.3,99.1 to 9.9,106.7
bRestrict: area 2.3,99 to 9.9,106.7; area 2.3,2.5 to 9.9,10.2; area 109.3,2.4 to 117.2,10.3; area 109.4,99 to 117.2,106.8

### Footprints (pad centres in the part's own frame; a part is rotated, then mirrored left to right if it is on the bottom)
1X02 = drill 1.016 long: 1 -1.27,0; 2 1.27,0
F25HP@1 = drill 1.1 pad 1.778 round: 1 -16.561,-1.27; 2 -13.792,-1.27; 3 -11.049,-1.27; 4 -8.28,-1.27; 5 -5.512,-1.27; 6 -2.769,-1.27; 7 0,-1.27; 8 2.769,-1.27; 9 5.512,-1.27; 10 8.28,-1.27; 11 11.049,-1.27; 12 13.792,-1.27; 13 16.561,-1.27; 14 -15.189,1.27; 15 -12.421,1.27; 16 -9.652,1.27; 17 -6.909,1.27; 18 -4.14,1.27; 19 -1.372,1.27; 20 1.372,1.27; 21 4.14,1.27; 22 6.909,1.27; 23 9.652,1.27; 24 12.421,1.27; 25 15.189,1.27 | drill 3.302 pad 5.08 round: G1 -23.52,0; G2 23.52,0
C0603 = smd 1.1 x 1: 1 -0.85,0; 2 0.85,0
C0402 = smd 0.7 x 0.9: 1 -0.65,0; 2 0.65,0
A/3216-18W = smd 2.15 x 1.8: + 1.475,0; - -1.475,0
1X03 = drill 1.016 long: 1 -2.54,0; 2 0,0; 3 2.54,0
SOT23 = smd 1 x 1.4: 1 -0.95,-1.1; 2 0.95,-1.1; 3 0,1.1
DO214AA = smd 1.8 x 2.2: A 2.55,0; C -2.55,0
KNF21 = smd 1 x 1: 1 -1.6,0; 3 1.6,0 | smd 0.6 x 1: 2A 0,0.8; 2B 0,-0.8
GAP = drill 1 pad 2.184 round: 1 -4.064,0; 2 4.064,0
MOLEX_FLEX8PIN = smd 0.6 x 2: 1 -3.19,-2.54; 2 -2.19,-2.54; 3 -1.19,-2.54; 4 -0.19,-2.54; 5 0.81,-2.54; 6 1.81,-2.54; 7 2.81,-2.54; 8 3.81,-2.54 | smd 1.5 x 1.8: NC1 -5.19,2.26; NC2 5.835,2.258
SSOP28 = smd 0.4 x 1.5: 1 -4.225,-3.625; 2 -3.575,-3.625; 3 -2.925,-3.625; 4 -2.275,-3.625; 5 -1.625,-3.625; 6 -0.975,-3.625; 7 -0.325,-3.625; 8 0.325,-3.625; 9 0.975,-3.625; 10 1.625,-3.625; 11 2.275,-3.625; 12 2.925,-3.625; 13 3.575,-3.625; 14 4.225,-3.625; 15 4.225,3.625; 16 3.575,3.625; 17 2.925,3.625; 18 2.275,3.625; 19 1.625,3.625; 20 0.975,3.625; 21 0.325,3.625; 22 -0.325,3.625; 23 -0.975,3.625; 24 -1.625,3.625; 25 -2.275,3.625; 26 -2.925,3.625; 27 -3.575,3.625; 28 -4.225,3.625
SO08 = smd 0.66 x 2.032: 1 -1.905,-3.073; 2 -0.635,-3.073; 3 0.635,-3.073; 4 1.905,-3.073; 5 1.905,3.073; 6 0.635,3.073; 7 -0.635,3.073; 8 -1.905,3.073
SO16W = smd 0.6 x 2.2: 1 -4.445,-4.6; 2 -3.175,-4.6; 3 -1.905,-4.6; 4 -0.635,-4.6; 5 0.635,-4.6; 6 1.905,-4.6; 7 3.175,-4.6; 8 4.445,-4.6; 9 4.445,4.6; 10 3.175,4.6; 11 1.905,4.6; 12 0.635,4.6; 13 -0.635,4.6; 14 -1.905,4.6; 15 -3.175,4.6; 16 -4.445,4.6
TSSOP24 = smd 0.305 x 0.991: 1 -3.575,-2.918; 2 -2.925,-2.918; 3 -2.275,-2.918; 4 -1.625,-2.918; 5 -0.975,-2.918; 6 -0.325,-2.918; 7 0.325,-2.918; 8 0.975,-2.918; 9 1.625,-2.918; 10 2.275,-2.918; 11 2.925,-2.918; 12 3.575,-2.918; 13 3.575,2.918; 14 2.925,2.918; 15 2.275,2.918; 16 1.625,2.918; 17 0.975,2.918; 18 0.325,2.918; 19 -0.325,2.918; 20 -0.975,2.918; 21 -1.625,2.918; 22 -2.275,2.918; 23 -2.925,2.918; 24 -3.575,2.918
SOT23-5 = smd 0.55 x 1.2: 1 -1.015,-1.2; 2 -0.065,-1.2; 3 0.885,-1.2; 4 0.885,1.4; 5 -1.015,1.4
26-SMD = smd 2.032 x 1.016: 1 -8.255,7.62; 3 -8.255,5.08; 5 -8.255,2.54; 9 -8.255,-2.54; 11 -8.255,-5.08; 13 -8.255,-7.62; 14 8.255,-7.62; 16 8.255,-5.08; 18 8.255,-2.54; 22 8.255,2.54; 24 8.255,5.08; 26 8.255,7.62
SO16 = smd 0.66 x 2.032: 1 -4.445,-3.073; 2 -3.175,-3.073; 3 -1.905,-3.073; 4 -0.635,-3.073; 5 0.635,-3.073; 6 1.905,-3.073; 7 3.175,-3.073; 8 4.445,-3.073; 9 4.445,3.073; 10 3.175,3.073; 11 1.905,3.073; 12 0.635,3.073; 13 -0.635,3.073; 14 -1.905,3.073; 15 -3.175,3.073; 16 -4.445,3.073
CHIPLED_1206 = smd 1.5 x 1.5: A 0,-1.75; C 0,1.75
FE20-2 = drill 1.1 pad 1.778 square: 1 -24.13,-1.27 | drill 1.1 pad 1.778 round: 2 -24.13,1.27; 3 -21.59,-1.27; 4 -21.59,1.27; 5 -19.05,-1.27; 6 -19.05,1.27; 7 -16.51,-1.27; 8 -16.51,1.27; 9 -13.97,-1.27; 10 -13.97,1.27; 11 -11.43,-1.27; 12 -11.43,1.27; 13 -8.89,-1.27; 14 -8.89,1.27; 15 -6.35,-1.27; 16 -6.35,1.27; 17 -3.81,-1.27; 18 -3.81,1.27; 19 -1.27,-1.27; 20 -1.27,1.27; 21 1.27,-1.27; 22 1.27,1.27; 23 3.81,-1.27; 24 3.81,1.27; 25 6.35,-1.27; 26 6.35,1.27; 27 8.89,-1.27; 28 8.89,1.27; 29 11.43,-1.27; 30 11.43,1.27; 31 13.97,-1.27; 32 13.97,1.27; 33 16.51,-1.27; 34 16.51,1.27; 35 19.05,-1.27; 36 19.05,1.27; 37 21.59,-1.27; 38 21.59,1.27; 39 24.13,-1.27; 40 24.13,1.27
R0603 = smd 1 x 1.1: 1 -0.85,0; 2 0.85,0
SHIELD_38X50 = smd 7.366 x 2.032: P$1 2.54,0; P$2 35.306,0; P$3 35.56,50.8; P$4 2.794,50.8 | smd 2.032 x 5.334: P$5 0.127,47.117; P$6 -0.127,3.683; P$7 37.973,3.683; P$8 38.227,47.117
SM49 = smd 5.08 x 1.778: 1 -4.826,0; 2 4.826,0

### Placement (x,y rotation side)
1PPS  113.22,22 90 top
ANALOG_INPUT  11.21,54.61 90 top
C1  27.5,44.96 0 top
C2  27.5,53.09 0 top
C3  27.5,61.21 0 top
C4  27.5,69.34 0 top
C5  27.5,39.88 0 top
C6  27.5,48.01 0 top
C7  27.5,56.13 0 top
C8  27.5,64.26 0 top
C9  43.04,62.23 180 top
C10  37.1,62.23 0 top
C11  59.73,36.22 270 bottom
C12  66.84,36.22 90 bottom
C13  66.84,40.69 270 bottom
C14  62.24,45.85 0 bottom
C15  66.84,49.66 90 bottom
C16  66.84,54.13 270 bottom
C17  46.24,20.93 90 top
C18  46.24,27.3 270 top
C19  50.13,61.59 180 bottom
C20  50.13,59.82 180 bottom
C21  60.41,65.99 270 bottom
C22  61.94,65.99 270 bottom
C23  58.84,68.78 270 bottom
C24  44.13,70.03 90 bottom
C25  44.13,66.47 270 bottom
C26  58.84,64.34 270 bottom
C27  58.22,61.56 0 bottom
C28  61.15,63.7 180 bottom
C29  49.16,51.89 90 bottom
C30  52.54,46.2 0 bottom
C31  53.45,58.57 180 bottom
C32  53.45,60.33 180 bottom
C33  54.78,61.59 180 bottom
C34  59.7,88.29 270 top
C35  59.7,81.89 90 top
C36  45.27,52.48 90 bottom
C37  40.2,39.14 90 bottom
C38  39.94,52.48 270 bottom
C39  42.58,56.03 0 bottom
C40  42.58,42.49 180 bottom
C41  45.26,39.14 270 bottom
C42  67.26,68.91 180 bottom
C43  63.02,68.91 0 bottom
C44  61.99,71.58 270 bottom
C45  27.22,47.93 90 bottom
C46  22.14,47.93 270 bottom
C47  24.68,51.23 0 bottom
C48  47.99,61.85 270 bottom
C49  47.99,65.15 270 bottom
C50  46.11,63.86 270 bottom
C51  111.75,36.55 180 top
C52  108.72,33.02 90 top
C53  111.75,28.91 180 top
C54  111.8,13.74 0 top
C55  37.53,103.73 90 bottom
C56  32.5,103.73 0 top
C57  16,102.83 270 top
C58  19.8,101.35 0 top
C59  22.56,77.08 180 top
C60  24.88,79.5 0 top
C61  27.22,63.42 90 bottom
C62  22.14,63.42 270 bottom
C63  24.68,66.73 0 bottom
C64  99.28,58.12 0 top
C65  102.48,58.12 0 top
C66  96,62.76 270 top
C67  104.89,55.91 270 top
C68  96,66.88 90 top
COM1  74.97,6.35 0 top
D1  42.02,68.33 0 top
D2  38.11,68.33 0 top
D3  98.01,22.25 0 bottom
D4  98.01,37.26 0 bottom
D5  84.01,37.26 0 bottom
D6  84.01,22.25 0 bottom
F1  51.68,43.1 0 bottom
F2  42.58,48.23 0 bottom
F3  42.58,34.85 180 bottom
F4  66.08,65.46 270 bottom
F5  24.68,42.85 0 bottom
F6  24.68,58.34 0 bottom
GAP1  97.98,34.29 0 top
GAP2  97.98,19.3 0 top
GAP3  84.01,19.3 0 top
GAP4  84.01,34.29 0 top
GPS  98.01,6.35 180 top
IC1  40.07,54.61 270 top
IC2  63.28,51.89 180 bottom
IC3  63.28,38.46 180 bottom
IC4  53.07,24.13 0 top
IC5  53.66,66.29 90 bottom
IC6  52.54,51.89 0 bottom
IC7  53.07,85.09 180 top
IC8  42.58,52.48 0 bottom
IC9  42.58,39.14 0 bottom
IC10  65.24,71.55 270 bottom
IC11  24.68,47.93 0 bottom
IC12  111.75,33.02 180 top
IC13  111.85,16.61 90 top
IC14  26.57,90.42 270 top
IC15  24.68,63.42 0 bottom
IC16  102.4,64.82 0 top
LED1  66.23,4.72 180 top
LED2  62.41,4.73 180 top
LOG  54.8,6.35 0 top
MOD1  83.73,102.9 0 top
R1  24.7,43.43 0 top
R2  21.91,44.96 0 top
R3  24.7,51.56 0 top
R4  21.91,53.09 0 top
R5  24.7,59.69 0 top
R6  21.91,61.21 0 top
R7  24.7,67.82 0 top
R8  21.91,69.34 0 top
R9  24.7,41.4 0 top
R10  21.91,39.88 0 top
R11  24.7,49.53 0 top
R12  21.91,48.01 0 top
R13  24.7,57.66 0 top
R14  21.91,56.13 0 top
R15  24.7,65.79 0 top
R16  21.91,64.26 0 top
R17  47.99,53.49 180 top
R18  47.97,51.79 180 top
R19  47.97,50.09 180 top
R20  47.97,55.25 180 top
R21  66.41,45.85 0 bottom
R22  59.73,40.69 270 bottom
R23  54.9,72.97 270 bottom
R24  52.44,72.97 270 bottom
R25  50.23,72.97 270 bottom
R26  57.09,72.97 270 bottom
R27  50.79,14.71 90 top
R28  52.31,14.71 90 top
R29  53.83,14.71 90 top
R30  56.26,15.58 180 top
R31  55.36,94.54 270 top
R32  53.83,94.54 270 top
R33  52.31,94.54 270 top
R34  50.79,94.54 270 top
R35  97.98,29.01 180 top
R36  97.98,14.02 180 top
R37  109.18,19.84 90 top
R38  88.81,97.28 270 bottom
R39  84.01,15.8 0 bottom
R40  84.01,30.78 0 bottom
R41  75.12,90.93 90 top
R42  77.66,90.93 90 top
R43  101.79,90.93 90 top
R44  104.33,90.93 90 top
R45  66.24,9.78 270 top
R46  62.43,9.78 270 top
SHIELD1  72.83,29.29 0 bottom
XTAL  40.53,68.25 270 bottom

### Tracks (layer width: path | path; a pad name or v marks a point on that pad's centre or on a via)
1PPS_0  (via drill 0.71 pad 1.4)
  Top 0.406: IC13.1 112.23,15.6 111.32,16.51 v105.85,16.51 | v105.85,9.52 102.55,6.22 96.08,6.22 95.2,7.1 GPS.7
  Bottom 0.406: v105.85,9.52 v105.85,16.51
2.5V_ANA
  Bottom 0.406: IC15.5 25.69,66.56 arc90 C63.1 25.53,67.78 22.14,71.17 ANALOG_INPUT.13
+3V3  (via drill 0.71 pad 1.4)
  Top 0.381: IC7.1 58.47,89.69 59.02,89.14 C34.1 60.69,89.14 62.17,90.61 v62.17,91.69 | v44.64,20.32 44.88,20.08 C17.1 47.33,20.08 47.88,19.53 IC4.1
  Top 0.406: IC16.16 97.95,66.57 97.41,66.03 C68.1 92.65,66.03 v92.65,66.04 | MOD1.1 59.6,98.34 62.17,95.77 v62.17,91.69 | v80.68,73.51 84.11,76.94 v84.11,79.6
  Bottom 0.406: v62.17,91.69 65.67,88.19 75.53,88.19 v84.11,79.6 92.65,71.07 v92.65,66.04 | v44.64,20.32 72.3,20.32 77.38,25.4 77.38,70.21 v80.68,73.51
+5V/1  (via drill 0.71 pad 1.4)
  Top 0.305: MOD1.2 60.87,102.89 60.87,99.48 61.57,98.78
  Top 0.406: IC12.3 110.86,33.47 111.32,33.02 112.46,33.02 112.76,33.32 IC12.1 112.76,35.26 112.6,35.42 C51.1 112.6,39.46 v112.61,39.47 | v32.32,105.66 31.65,104.99 C56.1 IC14.3 | v80.73,78.21 78.45,78.21 64.87,91.78 64.87,95.48 61.57,98.78
  Bottom 0.406: v112.61,39.47 112.61,42.14 90.55,64.2 90.55,68.39 v80.73,78.21 | v32.32,105.66 32.78,105.21 C55.+ 51.18,105.21 52.76,106.78 56.98,106.78 MOD1.2
AGND  (via drill 0.71 pad 1.4)
  Top 0.305: 34.95,51.43 35.2,51.69 IC1.12 | IC1.12 37.95,51.69 38.25,51.38 | IC1.12 | 34.9,57.23 35.26,56.87 38.51,56.87 | 35.51,55.09 35.66,54.94 38.35,54.94 | 41.61,57.07 42.06,57.53 45.92,57.53 | 42.06,56.11 42.6,55.58 45.42,55.58 45.62,55.78
  Top 0.381: 35.2,55.37 35.64,54.94 36.2,54.94
  other vias: 21.07,41.78 29.3,62.71 58.08,55.27 29.35,46.48
  pour Bottom (isolate 0.305): 0,109.22 30.04,109.22 30.04,95.88 39.56,86.36 77.03,86.36 77.03,22.86 39.56,22.86 30.04,13.34 30.04,0 0,0
  pour Top (isolate 0.305): 0,109.22 30.04,109.22 30.04,95.88 39.56,86.36 70.04,86.36 74.48,81.91 74.48,28.57 68.77,22.86 39.56,22.86 30.04,13.34 30.04,0 0,0
AIN_1A
  Top 0.381: IC1.19 42.57,52.98 41.76,52.17 41.76,49.17 33.99,41.4 R9.2
  Top 0.406: C5.1 25.92,39.88 25.55,40.25 R9.2
AIN_1B
  Top 0.381: IC1.11 34.43,52.33 29.11,57.66 R13.2
  Top 0.406: R13.2 25.55,56.6 26.02,56.13 C7.1
AIN_2A
  Top 0.381: IC1.20 42.26,53.63 40.97,52.35 40.97,49.48 34.93,43.43 R1.2
  Top 0.406: C1.1 25.95,44.96 25.55,44.56 R1.2
AIN_2B
  Top 0.381: IC1.10 34.7,52.98 31.98,55.7 31.98,57.81 30.1,59.69 R5.2
  Top 0.406: C3.1 26.05,61.21 25.55,60.72 R5.2
AIN_3A
  Top 0.381: R11.2 31.31,49.53 33.21,47.62 38.13,47.62 40.28,49.78 40.28,52.68 41.89,54.28 IC1.21
  Top 0.406: C6.1 25.9,48.01 25.55,48.35 R11.2
AIN_3B
  Top 0.381: R15.2 29.73,65.79 33.24,62.28 33.24,55.39 34.99,53.63 IC1.9
  Top 0.406: C8.1 25.95,64.26 25.55,64.66 R15.2
AIN_4A
  Top 0.381: R3.2 31.94,51.56 35.17,48.34 37.85,48.34 39.6,50.09 39.6,52.93 41.6,54.93 IC1.22
  Top 0.406: C2.1 25.95,53.09 25.55,52.69 R3.2
AIN_4B
  Top 0.381: R7.2 30.24,67.82 34.15,63.91 34.15,55.46 35.33,54.28 IC1.8
  Top 0.406: R7.2 25.55,69.1 25.79,69.34 C4.1
AIN_A
  Bottom 0.279: C26.1 59.22,64.99 C28.1
  Bottom 0.305: IC5.21 57.93,64.67 58.24,64.99 C26.1
  Bottom 0.406: C28.1 60.5,62.96 61.38,62.08 IC2.1
AIN_B
  Bottom 0.305: IC5.22 57.91,64.02 58.24,63.69 C26.2
  Bottom 0.406: IC3.1 61.38,43.23 59.56,45.05 59.56,61.21 59.22,61.56 C27.1 58.84,61.59 C26.2
AVDD
  Bottom 0.279: 43.6,56.03 C39.1
  Bottom 0.305: IC5.8 47.57,67.27 46.11,65.81 C50.1 | IC5.7 48.42,66.62 47.99,66.19 C49.1 47.2,65.8 46.9,65.51 46.9,64.69 46.71,64.51 C50.1 | C50.1 45.37,64.51 44.95,64.08 44.95,56.57 44.41,56.03 C39.1
  Bottom 0.406: IC8.5 43.6,56.03
AVSS  (via drill 0.71 pad 1.4)
  Top 0.406: v46.98,43.76 v46.98,47.68
  Bottom 0.305: IC5.6 49.67,65.97 48.91,65.2 48.91,62.92 48.49,62.5 C48.1 47.37,62.5 46.98,62.1 v46.98,47.68
  Bottom 0.406: IC9.5 44.03,40.54 44.58,39.99 C41.1 45.95,39.99 46.98,41.02 v46.98,43.76
CH_1A
  Top 0.406: R9.1 23.85,40.15 23.58,39.88 R10.2 22.76,38.9 21.91,38.05 ANALOG_INPUT.1
CH_1B
  Top 0.406: R14.2 23.51,56.13 23.85,56.48 R13.1 19.88,57.66 17.81,55.59 17.81,47.74 13.63,43.56 ANALOG_INPUT.3
CH_2A
  Top 0.305: ANALOG_INPUT.14 13.89,39.42
  Top 0.406: R2.2 23.53,44.96 23.85,44.64 R1.1 20.03,43.43 16.48,39.88 16.01,39.42 13.89,39.42
CH_2B
  Top 0.305: ANALOG_INPUT.16 13.69,44.96 14.81,46.08
  Top 0.406: R6.2 23.61,61.21 23.85,60.97 R5.1 19.08,59.69 16.84,57.45 16.84,48.49 16.84,48.32 16.84,48.11 14.81,46.08
CH_3A
  Top 0.406: R12.2 23.46,48.01 23.85,48.4 R11.1 22.67,49.53 22.64,49.5 20.38,49.5 19.62,48.74 19.62,46.1 14.34,40.82 ANALOG_INPUT.2
CH_3B
  Top 0.406: R16.2 23.46,64.26 23.85,64.66 R15.1 19.71,65.79 15.75,61.82 15.75,48.59 13.49,46.33 ANALOG_INPUT.4
CH_4A
  Top 0.305: ANALOG_INPUT.15 13.97,42.19 15.44,43.66
  Top 0.406: R4.2 23.51,53.09 23.85,52.74 R3.1 20.4,51.56 18.75,49.91 18.75,47.35 18.75,47 18.75,46.96 15.44,43.66
CH_4B
  Top 0.305: ANALOG_INPUT.17 13.39,47.7 14.05,48.36
  Top 0.406: R8.2 23.51,69.34 23.85,69 R7.1 18.47,67.82 14.61,63.96 14.61,49.38 14.61,49.29 14.61,48.92 14.05,48.36
GND
  Top 0.305: 111.9,16.89 112.26,16.54 113.07,16.54
  pour Bottom (isolate 0.305): 30.92,109.22 119.3,109.22 119.3,0 30.92,0 30.92,13.21 39.81,22.1 77.91,22.1 77.91,87.12 39.81,87.12 30.92,96.01
  pour Top (isolate 0.305): 30.92,109.22 30.92,96.01 39.81,87.12 70.68,87.12 75.5,82.3 75.5,28.19 69.41,22.1 39.81,22.1 30.92,13.21 30.92,0 119.3,0 119.3,109.22
N$1
  Bottom 0.406: F5.1 26.28,43.67 27.22,44.61 C45.1 26.87,46.73 IC11.1 25.69,47.46 25.2,47.96 24.13,47.96 23.79,47.62 IC11.3
N$2
  Bottom 0.279: 60.39,66.62 C21.1
  Bottom 0.305: IC5.18 60.39,66.62 | C21.1 C22.1
N$3
  Bottom 0.305: IC5.10 45.82,68.57 45.01,69.38 C24.1
  Bottom 0.406: C24.1 41.61,69.38 40.53,70.46 XTAL.1
N$5
  Bottom 0.305: IC5.5 50.12,65.32 49.48,64.68 C19.1 C20.1
N$6
  Bottom 0.406: F6.1 26.28,59.79 27.22,60.73 C61.1 26.47,62.57 26.12,62.22 IC15.1 25.69,63.06 25.32,63.42 24.1,63.42 23.79,63.11 IC15.3
N$7
  Bottom 0.305: IC5.9 45.81,67.92 45.01,67.12 C25.1
  Bottom 0.406: C25.1 41.58,67.12 40.53,66.07 XTAL.2
N$8
  Bottom 0.406: IC15.4 23.33,64.82 22.78,64.27 C62.1
N$9
  Bottom 0.406: F1.1 53.28,46.12 C30.1 IC6.2 53.17,50.24 52.17,51.24 C29.1
N$10  (via drill 3.68 pad 7.11)
  other vias: 6.08,6.35
N$11
  Bottom 0.305: IC5.4 52.6,64.67 54.13,63.15 C33.1
N$12  (via drill 3.68 pad 7.11)
  other vias: 6.08,102.87
N$13
  Bottom 0.305: C31.1 C32.1 52.8,63.21 52,64.02 IC5.3
  Bottom 0.406: 52.79,58.56 C31.1 52.8,57.57 51.9,56.67 IC6.6
N$14  (via drill 3.68 pad 7.11)
  other vias: 113.22,6.35
N$15
  Bottom 0.305: IC5.13 57.4,69.87 58.19,70.66 58.19,71.81 57.87,72.12 R26.2
N$16  (via drill 3.68 pad 7.11)
  other vias: 113.22,102.87
N$17
  Bottom 0.305: IC5.11 49.86,69.22 49.05,70.03 49.05,71.6 49.57,72.12 R25.2
N$18
  Top 0.381: IC1.18 44.54,52.33 45.44,53.24 45.44,54.18 46.51,55.24 R20.2
N$19
  Top 0.381: IC1.15 45.75,50.38 46.05,50.09 R19.2
N$20
  Top 0.381: IC1.16 45.75,51.03 46.51,51.79 R18.2
N$21
  Top 0.381: IC1.17 45.13,51.68 46.2,52.76 46.2,53.19 46.51,53.49 R17.2
N$22
  Bottom 0.305: IC5.12 51.48,69.87 52.44,70.83 R24.2
N$23
  Bottom 0.305: IC5.14 55.7,69.22 54.9,70.02 R23.2
N$24
  Bottom 0.406: 66.09,67.07 F4.1 66.08,67.75 66.41,68.09 C42.1 66.44,68.94 IC10.3 67.37,70.67 67.74,71.04 67.74,72.34 67.51,72.57 IC10.1
N$25
  Bottom 0.406: IC9.2 IC9.3 41.22,37.94 40.87,38.29 C37.1 40.2,36.53 40.98,35.74 F3.1
N$26
  Bottom 0.33: IC8.3 41.7,52.02 41.97,52.3 43.34,52.3 43.6,52.05 IC8.1
  Bottom 0.406: IC8.1 44.13,51.28 44.48,51.63 C36.1 45.28,48.79 44.72,48.23 F2.1
N$27
  Bottom 0.406: IC9.4 41.73,40.58 C40.1
N$28
  Top 0.381: IC7.3 54.98,92.47 55.36,92.85 R31.2
N$29
  Bottom 0.406: C38.1 40.92,53.33 41.47,53.88 IC8.4
N$30
  Bottom 0.406: C43.1 63.84,68.94 IC10.4
N$31
  Top 0.381: IC7.4 53.71,92.85 53.84,92.98 R32.2
N$32
  Bottom 0.406: IC2.6 63.92,46.99 65.06,45.85 R21.2
N$33
  Bottom 0.406: IC3.6 63.92,37.19 62.45,38.66 60.34,38.66 59.73,39.27 R22.2
N$34
  Top 0.381: IC7.5 52.44,92.88 52.31,93 R33.2
N$35
  Top 0.381: IC7.6 51.17,92.44 50.79,92.82 R34.2
N$36
  Bottom 0.406: IC11.4 23.26,49.33 22.71,48.78 C46.1
N$37
  Top 0.381: IC4.3 51.17,17.51 50.79,17.13 R27.2
N$38
  Top 0.381: R28.2 52.31,16.45 52.44,16.57 IC4.4
N$39
  Top 0.381: R29.2 53.84,16.57 53.71,16.7 IC4.5
N$40
  Top 0.406: IC4.6 54.98,17.18 55.41,16.75 R30.2
N$41
  Top 0.406: R37.2 109.22,20.73 1PPS.1
N$42
  Top 0.406: IC13.4 110.45,18.52 109.98,18.99 R37.1
N$43
  Bottom 0.305: MOD1.24 88.72,102.98 88.72,98.22 R38.1
N$44
  Top 0.406: IC16.1 97.95,59.49 98.43,59.02 C64.1
N$45
  Top 0.406: C52.1 109.75,32.17 110.3,31.62 IC12.4
N$46
  Top 0.406: IC16.3 100.49,59.49 100.13,59.12 C64.2
N$47
  Top 0.406: IC16.4 101.76,59.05 101.63,58.92 C65.1
N$48
  Top 0.406: IC16.5 103.03,59.69 103.33,59.4 C65.2
N$49
  Top 0.305: MOD1.10 71.02,102.91 71.02,100.67 71.78,99.91 71.78,99.9
  Top 0.406: 71.78,99.9 75.12,96.56 R41.2
N$50
  Top 0.406: C66.1 97.15,63.61 97.6,64.06 98.56,64.06 99.22,63.4 IC16.2
N$51
  Top 0.406: IC16.6 104.3,59.79 104.89,59.21 C67.1
N$52  (via drill 0.71 pad 1.4)
  Top 0.305: MOD1.8 68.48,102.91 68.48,100.67
  Top 0.33: v68.41,91.74 68.44,91.77
  Top 0.406: v80.05,91.8 77.67,91.8 R42.2 | 68.48,100.67 68.48,91.74 v68.41,91.74
  Bottom 0.406: v68.41,91.74 80,91.74 v80.05,91.8
N$53  (via drill 0.71 pad 1.4)
  Top 0.254: 101.76,91.81 R43.2
  Top 0.406: 101.76,91.81 101.76,92.53 v100.29,94.01
  Bottom 0.305: 99,100.6 99,102.87 MOD1.32
  Bottom 0.406: 99,100.6 99,95.3 v100.29,94.01
N$55
  Top 0.406: R44.2 104.33,94.15 100.24,98.23 MOD1.33
N$57
  Top 0.406: R45.2 66.24,6.48 LED1.A
N$63
  Top 0.406: LED2.A 62.43,6.51 R46.2 60.86,8.93 58.28,6.35 LOG.2
OUTA  (via drill 0.71 pad 1.4)
  Top 0.33: 41.59,72.16 41.28,72.16 40.82,71.7 40.82,68.68 41.07,68.43 D1.1 41.07,66.17 40.81,65.9 40.81,59.69 41.66,58.83 IC1.28
  Top 0.406: 41.59,72.16 57.75,72.16 62.67,67.23 v62.67,58.78
  Bottom 0.406: v62.67,58.78 62.65,58.75 IC2.2
OUTB  (via drill 0.71 pad 1.4)
  Top 0.33: 41.64,73.63 40.87,73.63 39.42,72.19 39.42,68.68 39.06,68.32 D2.2 39.06,66.2 39.34,65.91 39.34,59.79 37.74,58.18 IC1.2
  Top 0.406: v64.86,38.68 67.42,38.68 70.45,41.71 70.45,65.81 62.62,73.63 41.64,73.63
  Bottom 0.406: v64.86,38.68 64.15,38.68 62.65,40.18 IC3.2
OUTLED1  (via drill 0.71 pad 1.4)
  Top 0.406: R45.1 66.24,11.28 84.1,29.13 84.1,64.26 93.8,73.96 95.02,73.96 v96.32,75.26
  Bottom 0.305: 106.6,100.41 106.6,102.88 MOD1.38
  Bottom 0.406: 106.6,100.41 106.6,85.55 v96.32,75.26
OUTLED2  (via drill 0.71 pad 1.4)
  Top 0.406: R46.1 62.43,11.28 82.78,31.62 82.78,64.97 93.65,75.84 v93.65,76.12
  Bottom 0.406: MOD1.37 105.32,88.37 105.32,87.79 v93.65,76.12
PCRX_1  (via drill 0.71 pad 1.4)
  Top 0.406: IC16.14 100.49,69.96 99.8,70.66 94.44,70.66 88.05,64.27 v88.05,40.82
  Bottom 0.406: R40.1 84.86,34.3 86.56,36 D5.C 86.56,39.33 v88.05,40.82
PCTX_1  (via drill 0.71 pad 1.4)
  Top 0.406: IC16.13 101.76,70.61 100.24,72.14 93.95,72.14 85.55,63.73 85.55,27.67 v88.13,25.1
  Bottom 0.406: R39.1 84.86,19.29 86.56,20.99 D6.C 86.56,23.53 v88.13,25.1
PINA0_ANA
  Top 0.406: IC4.13 52.44,51.45 50.39,53.49 R17.1
PINA0_DIG  (via drill 0.71 pad 1.4)
  Top 0.406: R28.1 52.31,13.2 53.62,11.89 59,11.89 76.61,29.49 76.61,62.33 90.25,75.97 v90.25,79.55
  Bottom 0.406: v90.25,79.55 102.78,92.09 MOD1.35
PINA1_ANA
  Top 0.406: IC4.14 51.17,51.09 50.47,51.79 R18.1
PINA1_DIG  (via drill 0.71 pad 1.4)
  Top 0.406: R27.1 50.79,12.94 53.34,10.39 58.98,10.39 77.65,29.06 77.65,62.03 91.77,76.15 v91.77,77.95
  Bottom 0.305: 104.04,100.36 104.04,102.91 MOD1.36
  Bottom 0.406: v91.77,77.95 104.04,90.22 104.04,100.36
PINCS_ANA  (via drill 0.71 pad 1.4)
  Top 0.406: IC7.13 53.71,77.01 v54.9,75.82
  Bottom 0.406: R23.1 v54.9,75.82
PINCS_DIG  (via drill 0.71 pad 1.4)
  Top 0.33: R32.1 53.89,95.39
  Top 0.406: 53.89,95.39 53.89,96.81 54.51,97.43 56.91,97.43 v57.95,96.39
  Bottom 0.406: v57.95,96.39 88.81,96.42 R38.2
PINDIN_ANA  (via drill 0.71 pad 1.4)
  Top 0.381: 52.41,80.46 IC7.12
  Top 0.406: v52.41,75.84 52.41,80.46
  Bottom 0.305: R24.1 52.41,73.85
  Bottom 0.406: R24.1 52.67,73.85 | 52.41,73.85 v52.41,75.84
PINDIN_DIG  (via drill 0.71 pad 1.4)
  Top 0.406: R33.1 v52.31,100.05
  Bottom 0.33: 81.64,99.76 81.57,99.69
  Bottom 0.406: MOD1.19 82.46,100.58 81.64,99.76 81.42,99.54 52.79,99.54 52.31,100.03 v52.31,100.05
PINDOUT_ANA  (via drill 0.71 pad 1.4)
  Top 0.406: v50.1,75.87 50.1,77.46 51.17,78.52 IC7.11
  Bottom 0.406: R25.1 50.23,74.66 50.1,74.79 v50.1,75.87
PINDOUT_DIG  (via drill 0.71 pad 1.4)
  Top 0.406: R34.1 50.81,95.41 v50.81,98.02
  Bottom 0.406: v50.81,98.02 51.07,98.22 83.26,98.22 85,99.96 MOD1.21
PINSA_ANA  (via drill 0.71 pad 1.4)
  Top 0.406: IC4.12 53.71,41.21 59.66,47.17 v67.22,47.17
  Bottom 0.406: R21.1 67.26,47.13 v67.22,47.17
PINSA_DIG  (via drill 0.71 pad 1.4)
  Top 0.406: R29.1 59.55,13.86 75.54,29.84 75.54,62.84 88.49,75.79 v88.49,81.31
  Bottom 0.406: v88.49,81.31 97.7,90.51 MOD1.31
PINSB_ANA  (via drill 0.71 pad 1.4)
  Top 0.406: IC4.11 54.98,39.84 58.22,43.08 v59.73,43.08
  Bottom 0.406: v59.73,43.08 R22.1
PINSB_DIG  (via drill 0.71 pad 1.4)
  Top 0.406: R30.1 59.8,15.58 74.22,30 74.22,63.25 86.74,75.77 v86.74,83.03
  Bottom 0.406: v86.74,83.03 95.16,91.45 MOD1.29
PINSCK_ANA  (via drill 0.71 pad 1.4)
  Top 0.406: IC7.14 54.98,78.35 57.24,76.09 v57.24,75.84
  Bottom 0.406: R26.1 57.09,74.71 57.24,74.87 v57.24,75.84
PINSCK_DIG  (via drill 0.71 pad 1.32, 0.71 pad 1.4)
  Top 0.406: R31.1 56.17,95.39 57.94,93.62 v57.95,93.62 | v85.95,94.01 87.54,95.59 MOD1.23
  Bottom 0.406: v57.95,93.62 58.33,94.01 v85.95,94.01
RXGPS_0
  Top 0.406: GPS.5 97.2,10.82 91.45,16.56 91.45,24.4 96.06,29.01 R35.2 97.13,32.96 95.8,34.29 GAP1.1
RXGPS_1  (via drill 0.71 pad 1.4)
  Top 0.406: IC16.7 105.57,59.82 106.64,58.75 106.64,51.16 v102.35,46.86 | R35.1 101.82,29.01 v102.07,28.75
  Bottom 0.406: v102.07,28.75 99.43,31.39 99.43,34.85 100.56,35.98 D4.C 100.56,45.07 v102.35,46.86
RXGPS_TTL
  Top 0.406: R43.1 101.79,79.45 105.57,75.67 IC16.10
RXPC_0
  Bottom 0.406: COM1.1 72.43,18.34 83.16,29.07 R40.2 83.16,32.85 81.72,34.29 GAP4.1
RXPC_TTL
  Top 0.406: R42.1 87.81,90.08 104.3,73.58 IC16.11
TXGPS_0
  Top 0.406: GAP2.1 94.91,19.3 97.13,17.08 R36.2 97.13,13.11 98.2,12.04 GPS.4
TXGPS_1  (via drill 0.71 pad 1.4)
  Top 0.406: IC16.8 106.84,60.25 108.01,59.08 108.01,49.15 99.71,40.84 v98.06,40.84 | R36.1 98.83,21.86 v102.07,25.1
  Bottom 0.406: v98.06,40.84 98.06,29.11 100.56,26.61 100.56,25.12 | 100.56,25.12 D3.C | v102.07,25.1 102.04,25.12 100.56,25.12
TXGPS_TTL
  Top 0.406: R44.1 104.33,79.71 106.84,77.19 IC16.9
TXPC_0
  Bottom 0.406: COM1.3 77.51,8.89 83.16,14.54 R39.2 83.16,17.54 81.39,19.3 GAP3.1
TXPC_TTL
  Top 0.406: R41.1 75.12,88.39 75.83,87.68 87.11,87.68 103.03,71.75 IC16.12
V+  (via drill 0.71 pad 1.4)
  Top 0.381: v66.03,58.83 66.81,58.04
  Top 0.406: v56.04,46.74 58.64,49.33 69.09,49.33 69.11,49.3 | v25.79,35.69 31.38,35.69 v39.89,44.2 | IC14.13 C58.1 18.94,101.36 C57.+ 16,72.67 | 16,72.67 16,69.1 15.99,69.09 v15.99,68.86 | 16,72.67 28.69,72.67 36.25,65.11 C10.1 36.25,60.84 36.44,60.65 IC1.1 | v66.03,58.83 69.11,55.74 69.11,49.3 | 69.11,49.3 69.11,45.71 v66.87,43.46
  Bottom 0.381: F4.3 66.03,63.8 v66.03,58.83 66.84,58.01 C16.1
  Bottom 0.406: IC2.4 65.2,54.98 C16.1 | IC3.4 66.83,41.53 C13.1 66.87,41.57 v66.87,43.46 | v56.04,46.74 55.16,45.85 55.16,41.5 54.09,40.44 51.04,40.44 50.08,41.4 F1.3 50.08,45.19 49.42,45.85 41.01,45.85 40.98,45.87 | 40.93,48.18 F2.3 40.98,45.87 | F6.3 23.03,58.29 18.12,58.29 18.02,58.19 | v39.89,44.2 40.98,45.29 40.98,45.87 | 18.02,44.35 18.02,38.02 20.36,35.69 v25.79,35.69 | 18.02,44.35 18.02,58.19 | F5.3 23.08,43.84 22.54,44.37 18.05,44.37 18.02,44.35 | 18.02,58.19 18.02,66.83 v15.99,68.86
V-  (via drill 0.71 pad 1.4)
  Top 0.381: 45.12,62.23 45.73,61.62 45.73,59.27 44.65,58.18 IC1.27
  Top 0.406: v56.55,51.99 v62.65,51.99 | 45.12,62.23 C9.1 43.89,63.23 44.51,63.86 51.93,63.86 v56.55,59.23 | IC14.18 C60.1 C59.- v28.77,77.08 v28.77,77.09
  Bottom 0.406: C14.1 63.09,46.55 62.65,46.99 IC2.7 v62.65,51.99 | IC3.7 62.65,36.55 62.13,37.07 C11.1 59.69,37.11 57.37,37.11 57.34,37.08 | v56.55,59.23 v56.55,51.99 58.1,50.44 58.1,45.21 57.34,44.45 57.34,37.08 | 57.34,37.08 57.34,36.04 56.15,34.85 F3.3 44.18,27.58 41.95,25.35 34,25.35 32.19,27.15 32.19,70.08 28.77,73.51 v28.77,77.09
VCC  (via drill 0.71 pad 1.4)
  Top 0.381: R20.1 48.82,56.48 49.54,57.2 57.7,57.2 59.27,58.78 59.27,62.36 v53.71,67.92
  Bottom 0.279: IC5.16
  Bottom 0.305: IC5.16 57.24,67.92 57.8,68.48 57.8,69.06 58.17,69.43 C23.1 | IC5.16 v53.71,67.92
  Bottom 0.381: 70.14,48.77 70.14,73.46 67.09,76.5 64.07,76.5 61.99,74.42 C44.1 | 70.14,48.77 70.14,36.55 68.96,35.37 C12.1 IC3.5 | C15.1 70.1,48.81 70.14,48.77
  Bottom 0.406: C23.1 58.84,70.54 60.73,72.43 C44.1 61.99,72.57 IC10.5 | IC2.5 65.2,48.81 C15.1 | IC3.5 65.2,35.37
VCCIO  (via drill 0.71 pad 1.4)
  Top 0.381: IC7.16 58.47,80.49 59.02,81.04 C35.1 60.95,81.04 62.97,83.06 v63.18,83.06 | IC4.16 47.78,28.73 47.21,28.15 C18.1 30.38,28.15 v28.38,26.16
  Bottom 0.406: IC11.5 25.69,50.27 25.53,50.43 C47.1 30.8,51.23 30.82,51.26 | v63.18,83.06 28.17,83.06 24.97,79.86 24.97,72.5 30.82,66.55 30.82,51.26 | 30.82,51.26 30.82,28.6 v28.38,26.16
VGPS_3V3
  Top 0.406: IC12.5 112.76,28.91 C53.1 113.77,28.91 116.26,26.42 116.26,14.08 115.76,13.59 115.7,13.53 114.24,12.06 110.93,12.06 | 110.93,12.06 101.03,12.06 99.2,10.23 GPS.3 | 110.93,12.06 110.93,13.73 C54.1 110.95,14.59 110.45,15.09 IC13.5

### Text on the board
tPlace: RVRQ-JUL21
bPlace: C43 | C26 | C19 | C33 | C32